# Altium project SOM Board with RK3399.PrjPcb
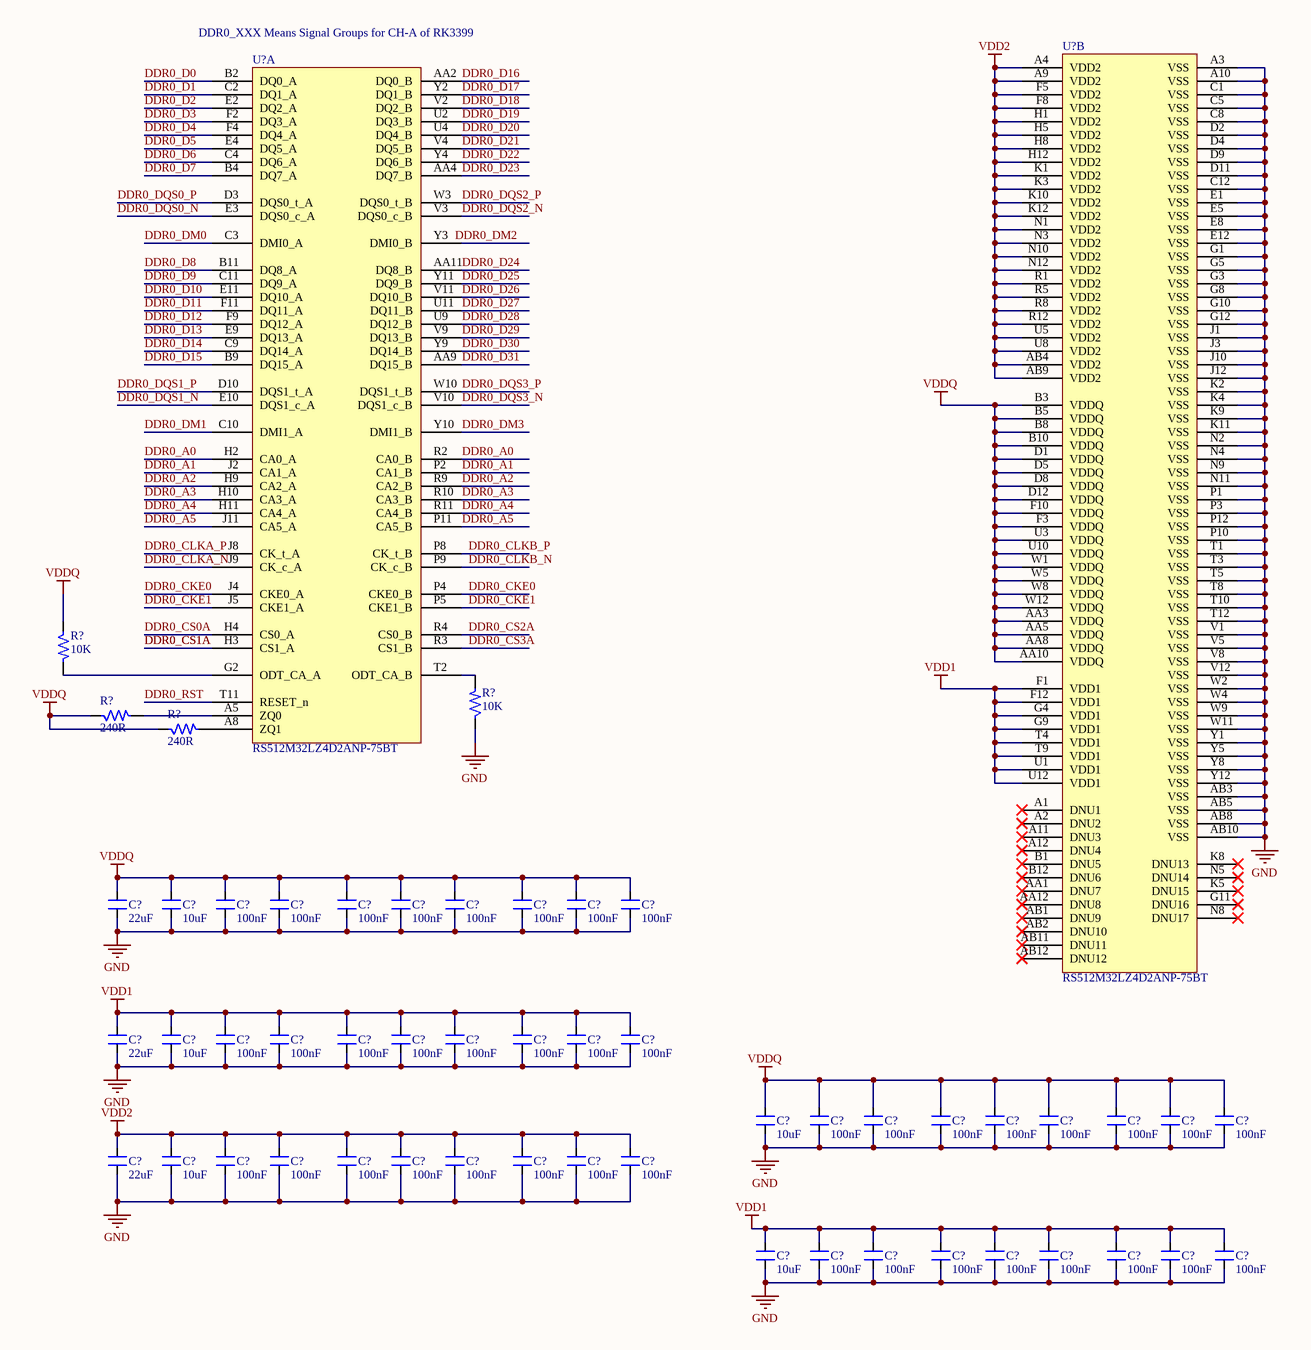
[diagram p0: [1]-LPDDR4 SDRAM-1.SchDoc]
7 sheets, 212 parts. Net scope: global (net labels, ports and power ports of the same name join across sheets).
Sheets:
  [1]-LPDDR4 SDRAM-1.SchDoc
  [2]-LPDDR4 SDRAM-2.SchDoc
  [3]-EMMC Chip.SchDoc
  [4]-WIFI Module WF60.SchDoc
  [5]-Block Diagram of SOM.SchDoc
  [6]-Power Pins Page of RK3399.SchDoc
  [7]-RK3399 SDRAM Page.SchDoc

## Sheet [1]-LPDDR4 SDRAM-1.SchDoc
size A3

### Parts
(Parts that share a designator on the sheet are numbered #1, #2 ... from top to bottom, then left to right.)
C?#1  22uF  [CAP_0603]
C?#2  10uF  [CAP_0603]
C?#3  100nF  [CAP_0201]
C?#4  100nF  [CAP_0201]
C?#5  100nF  [CAP_0201]
C?#6  100nF  [CAP_0201]
C?#7  100nF  [CAP_0201]
C?#8  100nF  [CAP_0201]
C?#9  100nF  [CAP_0201]
C?#10  100nF  [CAP_0201]
C?#11  22uF  [CAP_0603]
C?#12  10uF  [CAP_0603]
C?#13  100nF  [CAP_0201]
C?#14  100nF  [CAP_0201]
C?#15  100nF  [CAP_0201]
C?#16  100nF  [CAP_0201]
C?#17  100nF  [CAP_0201]
C?#18  100nF  [CAP_0201]
C?#19  100nF  [CAP_0201]
C?#20  100nF  [CAP_0201]
C?#21  10uF  [CAP_0603]
C?#22  100nF  [CAP_0201]
C?#23  100nF  [CAP_0201]
C?#24  100nF  [CAP_0201]
C?#25  100nF  [CAP_0201]
C?#26  100nF  [CAP_0201]
C?#27  100nF  [CAP_0201]
C?#28  100nF  [CAP_0201]
C?#29  100nF  [CAP_0201]
C?#30  22uF  [CAP_0603]
C?#31  10uF  [CAP_0603]
C?#32  100nF  [CAP_0201]
C?#33  100nF  [CAP_0201]
C?#34  100nF  [CAP_0201]
C?#35  100nF  [CAP_0201]
C?#36  100nF  [CAP_0201]
C?#37  100nF  [CAP_0201]
C?#38  100nF  [CAP_0201]
C?#39  100nF  [CAP_0201]
C?#40  10uF  [CAP_0603]
C?#41  100nF  [CAP_0201]
C?#42  100nF  [CAP_0201]
C?#43  100nF  [CAP_0201]
C?#44  100nF  [CAP_0201]
C?#45  100nF  [CAP_0201]
C?#46  100nF  [CAP_0201]
C?#47  100nF  [CAP_0201]
C?#48  100nF  [CAP_0201]
R?#1  10K  [RES_0201]
R?#2  240R  [RES_0201]
R?#3  240R  [RES_0201]
R?#4  10K  [RES_0201]
U?#1  RS512M32LZ4D2ANP-75BT  [FBGA200_SMD]  (part B of 2)
U?#2  RS512M32LZ4D2ANP-75BT  [FBGA200_SMD]  (part A of 2)

### Nets
GND: C?#1.1 C?#2.1 C?#3.1 C?#4.1 C?#5.1 C?#6.1 C?#7.1 C?#8.1 C?#9.1 C?#10.1 C?#11.1 C?#12.1 C?#13.1 C?#14.1 C?#15.1 C?#16.1 C?#17.1 C?#18.1 C?#19.1 C?#20.1 C?#21.1 C?#22.1 C?#23.1 C?#24.1 C?#25.1 C?#26.1 C?#27.1 C?#28.1 C?#29.1 C?#30.1 C?#31.1 C?#32.1 C?#33.1 C?#34.1 C?#35.1 C?#36.1 C?#37.1 C?#38.1 C?#39.1 C?#40.1 C?#41.1 C?#42.1 C?#43.1 C?#44.1 C?#45.1 C?#46.1 C?#47.1 C?#48.1 R?#4.1 U?#1.A3(VSS) U?#1.A10(VSS) U?#1.AB3(VSS) U?#1.AB5(VSS) U?#1.AB8(VSS) U?#1.AB10(VSS) U?#1.C1(VSS) U?#1.C5(VSS) U?#1.C8(VSS) U?#1.C12(VSS) U?#1.D2(VSS) U?#1.D4(VSS) U?#1.D9(VSS) U?#1.D11(VSS) U?#1.E1(VSS) U?#1.E5(VSS) U?#1.E8(VSS) U?#1.E12(VSS) U?#1.G1(VSS) U?#1.G3(VSS) U?#1.G5(VSS) U?#1.G8(VSS) U?#1.G10(VSS) U?#1.G12(VSS) U?#1.J1(VSS) U?#1.J3(VSS) U?#1.J10(VSS) U?#1.J12(VSS) U?#1.K2(VSS) U?#1.K4(VSS) U?#1.K9(VSS) U?#1.K11(VSS) U?#1.N2(VSS) U?#1.N4(VSS) U?#1.N9(VSS) U?#1.N11(VSS) U?#1.P1(VSS) U?#1.P3(VSS) U?#1.P10(VSS) U?#1.P12(VSS) U?#1.T1(VSS) U?#1.T3(VSS) U?#1.T5(VSS) U?#1.T8(VSS) U?#1.T10(VSS) U?#1.T12(VSS) U?#1.V1(VSS) U?#1.V5(VSS) U?#1.V8(VSS) U?#1.V12(VSS) U?#1.W2(VSS) U?#1.W4(VSS) U?#1.W9(VSS) U?#1.W11(VSS) U?#1.Y1(VSS) U?#1.Y5(VSS) U?#1.Y8(VSS) U?#1.Y12(VSS)
VDD1: C?#11.2 C?#12.2 C?#13.2 C?#14.2 C?#15.2 C?#16.2 C?#17.2 C?#18.2 C?#19.2 C?#20.2 C?#40.2 C?#41.2 C?#42.2 C?#43.2 C?#44.2 C?#45.2 C?#46.2 C?#47.2 C?#48.2 U?#1.F1(VDD1) U?#1.F12(VDD1) U?#1.G4(VDD1) U?#1.G9(VDD1) U?#1.T4(VDD1) U?#1.T9(VDD1) U?#1.U1(VDD1) U?#1.U12(VDD1)
VDD2: C?#30.2 C?#31.2 C?#32.2 C?#33.2 C?#34.2 C?#35.2 C?#36.2 C?#37.2 C?#38.2 C?#39.2 U?#1.A4(VDD2) U?#1.A9(VDD2) U?#1.AB4(VDD2) U?#1.AB9(VDD2) U?#1.F5(VDD2) U?#1.F8(VDD2) U?#1.H1(VDD2) U?#1.H5(VDD2) U?#1.H8(VDD2) U?#1.H12(VDD2) U?#1.K1(VDD2) U?#1.K3(VDD2) U?#1.K10(VDD2) U?#1.K12(VDD2) U?#1.N1(VDD2) U?#1.N3(VDD2) U?#1.N10(VDD2) U?#1.N12(VDD2) U?#1.R1(VDD2) U?#1.R5(VDD2) U?#1.R8(VDD2) U?#1.R12(VDD2) U?#1.U5(VDD2) U?#1.U8(VDD2)
VDDQ: C?#1.2 C?#2.2 C?#3.2 C?#4.2 C?#5.2 C?#6.2 C?#7.2 C?#8.2 C?#9.2 C?#10.2 C?#21.2 C?#22.2 C?#23.2 C?#24.2 C?#25.2 C?#26.2 C?#27.2 C?#28.2 C?#29.2 R?#1.1 R?#2.1 R?#3.1 U?#1.AA3(VDDQ) U?#1.AA5(VDDQ) U?#1.AA8(VDDQ) U?#1.AA10(VDDQ) U?#1.B3(VDDQ) U?#1.B5(VDDQ) U?#1.B8(VDDQ) U?#1.B10(VDDQ) U?#1.D1(VDDQ) U?#1.D5(VDDQ) U?#1.D8(VDDQ) U?#1.D12(VDDQ) U?#1.F3(VDDQ) U?#1.F10(VDDQ) U?#1.U3(VDDQ) U?#1.U10(VDDQ) U?#1.W1(VDDQ) U?#1.W5(VDDQ) U?#1.W8(VDDQ) U?#1.W12(VDDQ)
DDR0_A0: U?#2.H2(CA0_A) U?#2.R2(CA0_B)
DDR0_A1: U?#2.J2(CA1_A) U?#2.P2(CA1_B)
DDR0_A2: U?#2.H9(CA2_A) U?#2.R9(CA2_B)
DDR0_A3: U?#2.H10(CA3_A) U?#2.R10(CA3_B)
DDR0_A4: U?#2.H11(CA4_A) U?#2.R11(CA4_B)
DDR0_A5: U?#2.J11(CA5_A) U?#2.P11(CA5_B)
DDR0_CKE0: U?#2.J4(CKE0_A) U?#2.P4(CKE0_B)
DDR0_CKE1: U?#2.J5(CKE1_A) U?#2.P5(CKE1_B)
DDR0_CLKA_N: U?#2.J9(CK_c_A)
DDR0_CLKA_P: U?#2.J8(CK_t_A)
DDR0_CLKB_N: U?#2.P9(CK_c_B)
DDR0_CLKB_P: U?#2.P8(CK_t_B)
DDR0_CS0A: U?#2.H4(CS0_A)
DDR0_CS1A: U?#2.H3(CS1_A)
DDR0_CS2A: U?#2.R4(CS0_B)
DDR0_CS3A: U?#2.R3(CS1_B)
DDR0_D0: U?#2.B2(DQ0_A)
DDR0_D1: U?#2.C2(DQ1_A)
DDR0_D2: U?#2.E2(DQ2_A)
DDR0_D3: U?#2.F2(DQ3_A)
DDR0_D4: U?#2.F4(DQ4_A)
DDR0_D5: U?#2.E4(DQ5_A)
DDR0_D6: U?#2.C4(DQ6_A)
DDR0_D7: U?#2.B4(DQ7_A)
DDR0_D8: U?#2.B11(DQ8_A)
DDR0_D9: U?#2.C11(DQ9_A)
DDR0_D10: U?#2.E11(DQ10_A)
DDR0_D11: U?#2.F11(DQ11_A)
DDR0_D12: U?#2.F9(DQ12_A)
DDR0_D13: U?#2.E9(DQ13_A)
DDR0_D14: U?#2.C9(DQ14_A)
DDR0_D15: U?#2.B9(DQ15_A)
DDR0_D16: U?#2.AA2(DQ0_B)
DDR0_D17: U?#2.Y2(DQ1_B)
DDR0_D18: U?#2.V2(DQ2_B)
DDR0_D19: U?#2.U2(DQ3_B)
DDR0_D20: U?#2.U4(DQ4_B)
DDR0_D21: U?#2.V4(DQ5_B)
DDR0_D22: U?#2.Y4(DQ6_B)
DDR0_D23: U?#2.AA4(DQ7_B)
DDR0_D24: U?#2.AA11(DQ8_B)
DDR0_D25: U?#2.Y11(DQ9_B)
DDR0_D26: U?#2.V11(DQ10_B)
DDR0_D27: U?#2.U11(DQ11_B)
DDR0_D28: U?#2.U9(DQ12_B)
DDR0_D29: U?#2.V9(DQ13_B)
DDR0_D30: U?#2.Y9(DQ14_B)
DDR0_D31: U?#2.AA9(DQ15_B)
DDR0_DM0: U?#2.C3(DMI0_A)
DDR0_DM1: U?#2.C10(DMI1_A)
DDR0_DM3: U?#2.Y10(DMI1_B)
DDR0_DQS0_N: U?#2.E3(DQS0_c_A)
DDR0_DQS0_P: U?#2.D3(DQS0_t_A)
DDR0_DQS1_N: U?#2.E10(DQS1_c_A)
DDR0_DQS1_P: U?#2.D10(DQS1_t_A)
DDR0_DQS2_N: U?#2.V3(DQS0_c_B)
DDR0_DQS2_P: U?#2.W3(DQS0_t_B)
DDR0_DQS3_N: U?#2.V10(DQS1_c_B)
DDR0_DQS3_P: U?#2.W10(DQS1_t_B)
DDR0_RST: U?#2.T11(RESET_n)
NetR?#1_2: R?#1.2 U?#2.G2(ODT_CA_A)
NetR?#2_2: R?#2.2 U?#2.A5(ZQ0)
NetR?#3_2: R?#3.2 U?#2.A8(ZQ1)
NetR?#4_2: R?#4.2 U?#2.T2(ODT_CA_B)

Not connected (* = marked no-connect by the designer): U?#1 A1(DNU1)* A2(DNU2)* A11(DNU3)* A12(DNU4)* AA1(DNU7)* AA12(DNU8)* AB1(DNU9)* AB2(DNU10)* AB11(DNU11)* AB12(DNU12)* B1(DNU5)* B12(DNU6)* G11(DNU16)* K5(DNU15)* K8(DNU13)* N5(DNU14)* N8(DNU17)*; U?#2 Y3(DMI0_B)

### Notes on the sheet
- (near U?#2) DDR0_XXX Means Signal Groups for CH-A of RK3399
- Labels drawn without touching a wire or pin: DDR0_DM2
- Title
- Size:
- Date:
- A3
- Number:
- Time:
- Revision:
- Sheet
- of
- File:

### Library data of the parts
C?#1 C?#11 C?#30 = CAP_22uF-10V-20%-0603: 22µF ±20% 10V Ceramic Capacitor X5R 0603 (1608 Metric) /; Manufacturer: Murata Electronics; Manufacturer Part Number: GRM188R61A226ME15D; Case/Package: 0603; Supplier-1: Digikey
C?#2 C?#12 C?#21 C?#31 C?#40 = CAP_10uF-10V-10%-0603: 10µF ±10% 10V Ceramic Capacitor X5R 0603 (1608 Metric) /; Manufacturer Part Number: GRM188R61A106KE69J; Manufacturer: Murata Electronics; Case/Package: 0603; Supplier-1: Digikey
C?#3-C?#10 C?#13-C?#20 C?#22-C?#29 C?#32-C?#39 C?#41-C?#48 = CAP_100nF-25V-10%-0201: 0.1µF ±10% 25V Ceramic Capacitor X5R 0201 (0603 Metric) /; Manufacturer: TDK Corporation; Manufacturer Part Number: C0603X5R1E104K030BB; Case/Package: 0201; Supplier-1: Digikey
R?#1 R?#4 = RES_10K-0.05W-1%-0201: 10 kOhms ±1% 0.05W, 1/20W Chip Resistor 0201 (0603 Metric) Thick Film /; Manufacturer: Stackpole Electronics Inc; Manufacturer Part Number: RMCF0201FT10K0; Case/Package: 0201; Supplier-1: Digikey
R?#2 R?#3 = RES_240R-0.05W-1%-0201: 240 Ohms ±1% 0.05W, 1/20W Chip Resistor 0201 (0603 Metric) Thick Film /; Manufacturer: Yageo; Manufacturer Part Number: RC0201FR-07240RL; Case/Package: 0201; Supplier-1: Digikey
U?#1 U?#2 = IC_RS512M32LZ4D2ANP-75BT: LPDDR4/4X Package FBGA 200b Density 4Gbit~64Gbit Operating Temperature Range：-25~85℃ Speed：2667Mbps/3200Mbps/3733Mbps Voltage：VDD1/VDD2/VDDQ= 1.8 / 1.1 / 1.1 V（LPDDR4）VDD1/VDD2/VDDQ = 1.8 / 1.1 / 0.6 V（LPDDR4X）Approved Verification Platform：MTK、Spreadtrum; Manufacturer: RAYSON; Manufacturer Part Number: RS512M32LZ4D2ANP-75BT; Case/Package: FBGA 200b; Supplier-1: RAYSON

## Sheet [2]-LPDDR4 SDRAM-2.SchDoc
size A3; Organization: Altium Limited; Address1: L3, 12a Rodborough Rd; Address2: Frenchs Forest; Address3: NSW; Address4: Australia 2086
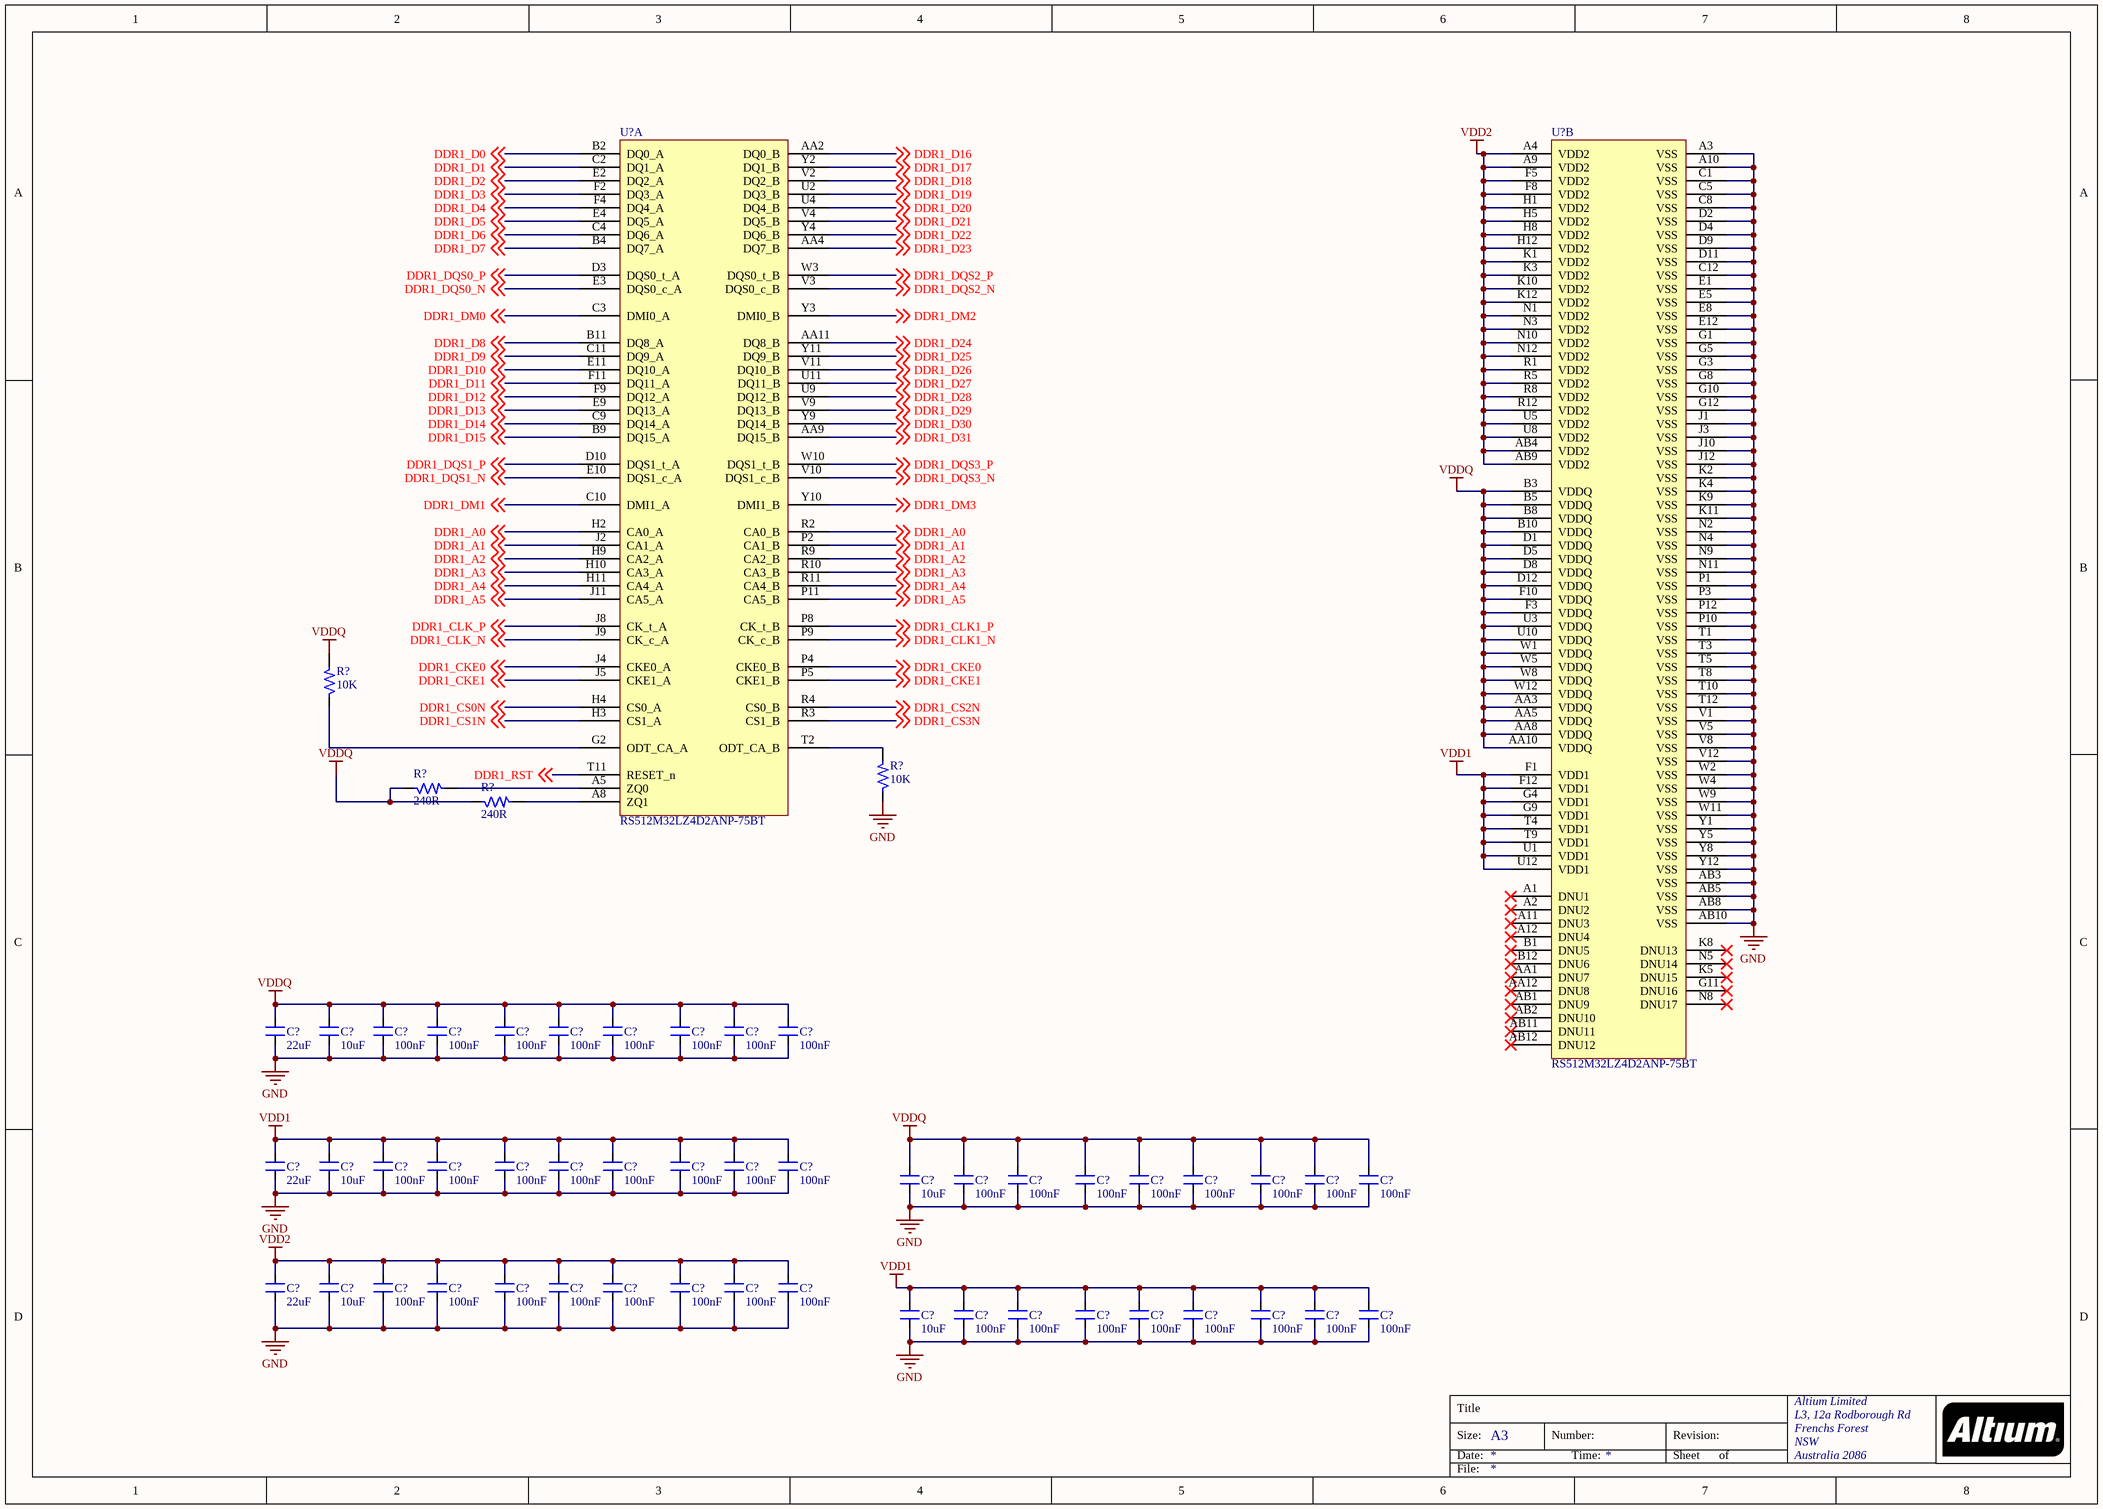
[diagram p1: [2]-LPDDR4 SDRAM-2.SchDoc]

### Parts
(Parts that share a designator on the sheet are numbered #1, #2 ... from top to bottom, then left to right.)
C?#49  22uF  [CAP_0603]
C?#50  10uF  [CAP_0603]
C?#51  100nF  [CAP_0201]
C?#52  100nF  [CAP_0201]
C?#53  100nF  [CAP_0201]
C?#54  100nF  [CAP_0201]
C?#55  100nF  [CAP_0201]
C?#56  100nF  [CAP_0201]
C?#57  100nF  [CAP_0201]
C?#58  100nF  [CAP_0201]
C?#59  22uF  [CAP_0603]
C?#60  10uF  [CAP_0603]
C?#61  100nF  [CAP_0201]
C?#62  100nF  [CAP_0201]
C?#63  100nF  [CAP_0201]
C?#64  100nF  [CAP_0201]
C?#65  100nF  [CAP_0201]
C?#66  100nF  [CAP_0201]
C?#67  100nF  [CAP_0201]
C?#68  100nF  [CAP_0201]
C?#69  10uF  [CAP_0603]
C?#70  100nF  [CAP_0201]
C?#71  100nF  [CAP_0201]
C?#72  100nF  [CAP_0201]
C?#73  100nF  [CAP_0201]
C?#74  100nF  [CAP_0201]
C?#75  100nF  [CAP_0201]
C?#76  100nF  [CAP_0201]
C?#77  100nF  [CAP_0201]
C?#78  22uF  [CAP_0603]
C?#79  10uF  [CAP_0603]
C?#80  100nF  [CAP_0201]
C?#81  100nF  [CAP_0201]
C?#82  100nF  [CAP_0201]
C?#83  100nF  [CAP_0201]
C?#84  100nF  [CAP_0201]
C?#85  100nF  [CAP_0201]
C?#86  100nF  [CAP_0201]
C?#87  100nF  [CAP_0201]
C?#88  10uF  [CAP_0603]
C?#89  100nF  [CAP_0201]
C?#90  100nF  [CAP_0201]
C?#91  100nF  [CAP_0201]
C?#92  100nF  [CAP_0201]
C?#93  100nF  [CAP_0201]
C?#94  100nF  [CAP_0201]
C?#95  100nF  [CAP_0201]
C?#96  100nF  [CAP_0201]
R?#5  10K  [RES_0201]
R?#6  240R  [RES_0201]
R?#7  240R  [RES_0201]
R?#8  10K  [RES_0201]
U?#3  RS512M32LZ4D2ANP-75BT  [FBGA200_SMD]  (part A of 2)
U?#4  RS512M32LZ4D2ANP-75BT  [FBGA200_SMD]  (part B of 2)

### Nets
GND: C?#49.1 C?#50.1 C?#51.1 C?#52.1 C?#53.1 C?#54.1 C?#55.1 C?#56.1 C?#57.1 C?#58.1 C?#59.1 C?#60.1 C?#61.1 C?#62.1 C?#63.1 C?#64.1 C?#65.1 C?#66.1 C?#67.1 C?#68.1 C?#69.1 C?#70.1 C?#71.1 C?#72.1 C?#73.1 C?#74.1 C?#75.1 C?#76.1 C?#77.1 C?#78.1 C?#79.1 C?#80.1 C?#81.1 C?#82.1 C?#83.1 C?#84.1 C?#85.1 C?#86.1 C?#87.1 C?#88.1 C?#89.1 C?#90.1 C?#91.1 C?#92.1 C?#93.1 C?#94.1 C?#95.1 C?#96.1 R?#8.1 U?#4.A3(VSS) U?#4.A10(VSS) U?#4.AB3(VSS) U?#4.AB5(VSS) U?#4.AB8(VSS) U?#4.AB10(VSS) U?#4.C1(VSS) U?#4.C5(VSS) U?#4.C8(VSS) U?#4.C12(VSS) U?#4.D2(VSS) U?#4.D4(VSS) U?#4.D9(VSS) U?#4.D11(VSS) U?#4.E1(VSS) U?#4.E5(VSS) U?#4.E8(VSS) U?#4.E12(VSS) U?#4.G1(VSS) U?#4.G3(VSS) U?#4.G5(VSS) U?#4.G8(VSS) U?#4.G10(VSS) U?#4.G12(VSS) U?#4.J1(VSS) U?#4.J3(VSS) U?#4.J10(VSS) U?#4.J12(VSS) U?#4.K2(VSS) U?#4.K4(VSS) U?#4.K9(VSS) U?#4.K11(VSS) U?#4.N2(VSS) U?#4.N4(VSS) U?#4.N9(VSS) U?#4.N11(VSS) U?#4.P1(VSS) U?#4.P3(VSS) U?#4.P10(VSS) U?#4.P12(VSS) U?#4.T1(VSS) U?#4.T3(VSS) U?#4.T5(VSS) U?#4.T8(VSS) U?#4.T10(VSS) U?#4.T12(VSS) U?#4.V1(VSS) U?#4.V5(VSS) U?#4.V8(VSS) U?#4.V12(VSS) U?#4.W2(VSS) U?#4.W4(VSS) U?#4.W9(VSS) U?#4.W11(VSS) U?#4.Y1(VSS) U?#4.Y5(VSS) U?#4.Y8(VSS) U?#4.Y12(VSS)
VDD1: C?#59.2 C?#60.2 C?#61.2 C?#62.2 C?#63.2 C?#64.2 C?#65.2 C?#66.2 C?#67.2 C?#68.2 C?#88.2 C?#89.2 C?#90.2 C?#91.2 C?#92.2 C?#93.2 C?#94.2 C?#95.2 C?#96.2 U?#4.F1(VDD1) U?#4.F12(VDD1) U?#4.G4(VDD1) U?#4.G9(VDD1) U?#4.T4(VDD1) U?#4.T9(VDD1) U?#4.U1(VDD1) U?#4.U12(VDD1)
VDD2: C?#78.2 C?#79.2 C?#80.2 C?#81.2 C?#82.2 C?#83.2 C?#84.2 C?#85.2 C?#86.2 C?#87.2 U?#4.A4(VDD2) U?#4.A9(VDD2) U?#4.AB4(VDD2) U?#4.AB9(VDD2) U?#4.F5(VDD2) U?#4.F8(VDD2) U?#4.H1(VDD2) U?#4.H5(VDD2) U?#4.H8(VDD2) U?#4.H12(VDD2) U?#4.K1(VDD2) U?#4.K3(VDD2) U?#4.K10(VDD2) U?#4.K12(VDD2) U?#4.N1(VDD2) U?#4.N3(VDD2) U?#4.N10(VDD2) U?#4.N12(VDD2) U?#4.R1(VDD2) U?#4.R5(VDD2) U?#4.R8(VDD2) U?#4.R12(VDD2) U?#4.U5(VDD2) U?#4.U8(VDD2)
VDDQ: C?#49.2 C?#50.2 C?#51.2 C?#52.2 C?#53.2 C?#54.2 C?#55.2 C?#56.2 C?#57.2 C?#58.2 C?#69.2 C?#70.2 C?#71.2 C?#72.2 C?#73.2 C?#74.2 C?#75.2 C?#76.2 C?#77.2 R?#5.2 R?#6.1 R?#7.1 U?#4.AA3(VDDQ) U?#4.AA5(VDDQ) U?#4.AA8(VDDQ) U?#4.AA10(VDDQ) U?#4.B3(VDDQ) U?#4.B5(VDDQ) U?#4.B8(VDDQ) U?#4.B10(VDDQ) U?#4.D1(VDDQ) U?#4.D5(VDDQ) U?#4.D8(VDDQ) U?#4.D12(VDDQ) U?#4.F3(VDDQ) U?#4.F10(VDDQ) U?#4.U3(VDDQ) U?#4.U10(VDDQ) U?#4.W1(VDDQ) U?#4.W5(VDDQ) U?#4.W8(VDDQ) U?#4.W12(VDDQ)
DDR1_A0: U?#3.H2(CA0_A) U?#3.R2(CA0_B) ; off-sheet DDR1_A0
DDR1_A1: U?#3.J2(CA1_A) U?#3.P2(CA1_B) ; off-sheet DDR1_A1
DDR1_A2: U?#3.H9(CA2_A) U?#3.R9(CA2_B) ; off-sheet DDR1_A2
DDR1_A3: U?#3.H10(CA3_A) U?#3.R10(CA3_B) ; off-sheet DDR1_A3
DDR1_A4: U?#3.H11(CA4_A) U?#3.R11(CA4_B) ; off-sheet DDR1_A4
DDR1_A5: U?#3.J11(CA5_A) U?#3.P11(CA5_B) ; off-sheet DDR1_A5
DDR1_CKE0: U?#3.J4(CKE0_A) U?#3.P4(CKE0_B) ; off-sheet DDR1_CKE0
DDR1_CKE1: U?#3.J5(CKE1_A) U?#3.P5(CKE1_B) ; off-sheet DDR1_CKE1
DDR1_CLK1_N: U?#3.P9(CK_c_B) ; off-sheet DDR1_CLK1_N
DDR1_CLK1_P: U?#3.P8(CK_t_B) ; off-sheet DDR1_CLK1_P
DDR1_CLK_N: U?#3.J9(CK_c_A) ; off-sheet DDR1_CLK_N
DDR1_CLK_P: U?#3.J8(CK_t_A) ; off-sheet DDR1_CLK_P
DDR1_CS0N: U?#3.H4(CS0_A) ; off-sheet DDR1_CS0N
DDR1_CS1N: U?#3.H3(CS1_A) ; off-sheet DDR1_CS1N
DDR1_CS2N: U?#3.R4(CS0_B) ; off-sheet DDR1_CS2N
DDR1_CS3N: U?#3.R3(CS1_B) ; off-sheet DDR1_CS3N
DDR1_D0: U?#3.B2(DQ0_A) ; off-sheet DDR1_D0
DDR1_D1: U?#3.C2(DQ1_A) ; off-sheet DDR1_D1
DDR1_D2: U?#3.E2(DQ2_A) ; off-sheet DDR1_D2
DDR1_D3: U?#3.F2(DQ3_A) ; off-sheet DDR1_D3
DDR1_D4: U?#3.F4(DQ4_A) ; off-sheet DDR1_D4
DDR1_D5: U?#3.E4(DQ5_A) ; off-sheet DDR1_D5
DDR1_D6: U?#3.C4(DQ6_A) ; off-sheet DDR1_D6
DDR1_D7: U?#3.B4(DQ7_A) ; off-sheet DDR1_D7
DDR1_D8: U?#3.B11(DQ8_A) ; off-sheet DDR1_D8
DDR1_D9: U?#3.C11(DQ9_A) ; off-sheet DDR1_D9
DDR1_D10: U?#3.E11(DQ10_A) ; off-sheet DDR1_D10
DDR1_D11: U?#3.F11(DQ11_A) ; off-sheet DDR1_D11
DDR1_D12: U?#3.F9(DQ12_A) ; off-sheet DDR1_D12
DDR1_D13: U?#3.E9(DQ13_A) ; off-sheet DDR1_D13
DDR1_D14: U?#3.C9(DQ14_A) ; off-sheet DDR1_D14
DDR1_D15: U?#3.B9(DQ15_A) ; off-sheet DDR1_D15
DDR1_D16: U?#3.AA2(DQ0_B) ; off-sheet DDR1_D16
DDR1_D17: U?#3.Y2(DQ1_B) ; off-sheet DDR1_D17
DDR1_D18: U?#3.V2(DQ2_B) ; off-sheet DDR1_D18
DDR1_D19: U?#3.U2(DQ3_B) ; off-sheet DDR1_D19
DDR1_D20: U?#3.U4(DQ4_B) ; off-sheet DDR1_D20
DDR1_D21: U?#3.V4(DQ5_B) ; off-sheet DDR1_D21
DDR1_D22: U?#3.Y4(DQ6_B) ; off-sheet DDR1_D22
DDR1_D23: U?#3.AA4(DQ7_B) ; off-sheet DDR1_D23
DDR1_D24: U?#3.AA11(DQ8_B) ; off-sheet DDR1_D24
DDR1_D25: U?#3.Y11(DQ9_B) ; off-sheet DDR1_D25
DDR1_D26: U?#3.V11(DQ10_B) ; off-sheet DDR1_D26
DDR1_D27: U?#3.U11(DQ11_B) ; off-sheet DDR1_D27
DDR1_D28: U?#3.U9(DQ12_B) ; off-sheet DDR1_D28
DDR1_D29: U?#3.V9(DQ13_B) ; off-sheet DDR1_D29
DDR1_D30: U?#3.Y9(DQ14_B) ; off-sheet DDR1_D30
DDR1_D31: U?#3.AA9(DQ15_B) ; off-sheet DDR1_D31
DDR1_DM0: U?#3.C3(DMI0_A) ; off-sheet DDR1_DM0
DDR1_DM1: U?#3.C10(DMI1_A) ; off-sheet DDR1_DM1
DDR1_DM2: U?#3.Y3(DMI0_B) ; off-sheet DDR1_DM2
DDR1_DM3: U?#3.Y10(DMI1_B) ; off-sheet DDR1_DM3
DDR1_DQS0_N: U?#3.E3(DQS0_c_A) ; off-sheet DDR1_DQS0_N
DDR1_DQS0_P: U?#3.D3(DQS0_t_A) ; off-sheet DDR1_DQS0_P
DDR1_DQS1_N: U?#3.E10(DQS1_c_A) ; off-sheet DDR1_DQS1_N
DDR1_DQS1_P: U?#3.D10(DQS1_t_A) ; off-sheet DDR1_DQS1_P
DDR1_DQS2_N: U?#3.V3(DQS0_c_B) ; off-sheet DDR1_DQS2_N
DDR1_DQS2_P: U?#3.W3(DQS0_t_B) ; off-sheet DDR1_DQS2_P
DDR1_DQS3_N: U?#3.V10(DQS1_c_B) ; off-sheet DDR1_DQS3_N
DDR1_DQS3_P: U?#3.W10(DQS1_t_B) ; off-sheet DDR1_DQS3_P
DDR1_RST: U?#3.T11(RESET_n) ; off-sheet DDR1_RST
NetR?#5_1: R?#5.1 U?#3.G2(ODT_CA_A)
NetR?#6_2: R?#6.2 U?#3.A5(ZQ0)
NetR?#7_2: R?#7.2 U?#3.A8(ZQ1)
NetR?#8_2: R?#8.2 U?#3.T2(ODT_CA_B)

Not connected (* = marked no-connect by the designer): U?#4 A1(DNU1)* A2(DNU2)* A11(DNU3)* A12(DNU4)* AA1(DNU7)* AA12(DNU8)* AB1(DNU9)* AB2(DNU10)* AB11(DNU11)* AB12(DNU12)* B1(DNU5)* B12(DNU6)* G11(DNU16)* K5(DNU15)* K8(DNU13)* N5(DNU14)* N8(DNU17)*

### Notes on the sheet
- Title
- Size:
- Date:
- A3
- Number:
- Time:
- Revision:
- Sheet
- of
- File:

### Library data of the parts
C?#49 C?#59 C?#78 = CAP_22uF-10V-20%-0603: as C?#1 on sheet [1]-LPDDR4 SDRAM-1; Case/Package: 0603; Supplier-1: Digikey
C?#50 C?#60 C?#69 C?#79 C?#88 = CAP_10uF-10V-10%-0603: as C?#2 on sheet [1]-LPDDR4 SDRAM-1; Case/Package: 0603; Supplier-1: Digikey
C?#51-C?#58 C?#61-C?#68 C?#70-C?#77 C?#80-C?#87 C?#89-C?#96 = CAP_100nF-25V-10%-0201: as C?#3 on sheet [1]-LPDDR4 SDRAM-1; Case/Package: 0201; Supplier-1: Digikey
R?#5 R?#8 = RES_10K-0.05W-1%-0201: as R?#1 on sheet [1]-LPDDR4 SDRAM-1; Case/Package: 0201; Supplier-1: Digikey
R?#6 R?#7 = RES_240R-0.05W-1%-0201: as R?#2 on sheet [1]-LPDDR4 SDRAM-1; Case/Package: 0201; Supplier-1: Digikey
U?#3 U?#4 = IC_RS512M32LZ4D2ANP-75BT: as U?#1 on sheet [1]-LPDDR4 SDRAM-1; Manufacturer Part Number: RS512M32LZ4D2ANP-75BT; Case/Package: FBGA 200b; Supplier-1: RAYSON

## Sheet [3]-EMMC Chip.SchDoc
size A3; Organization: Altium Limited; Address1: L3, 12a Rodborough Rd; Address2: Frenchs Forest; Address3: NSW; Address4: Australia 2086
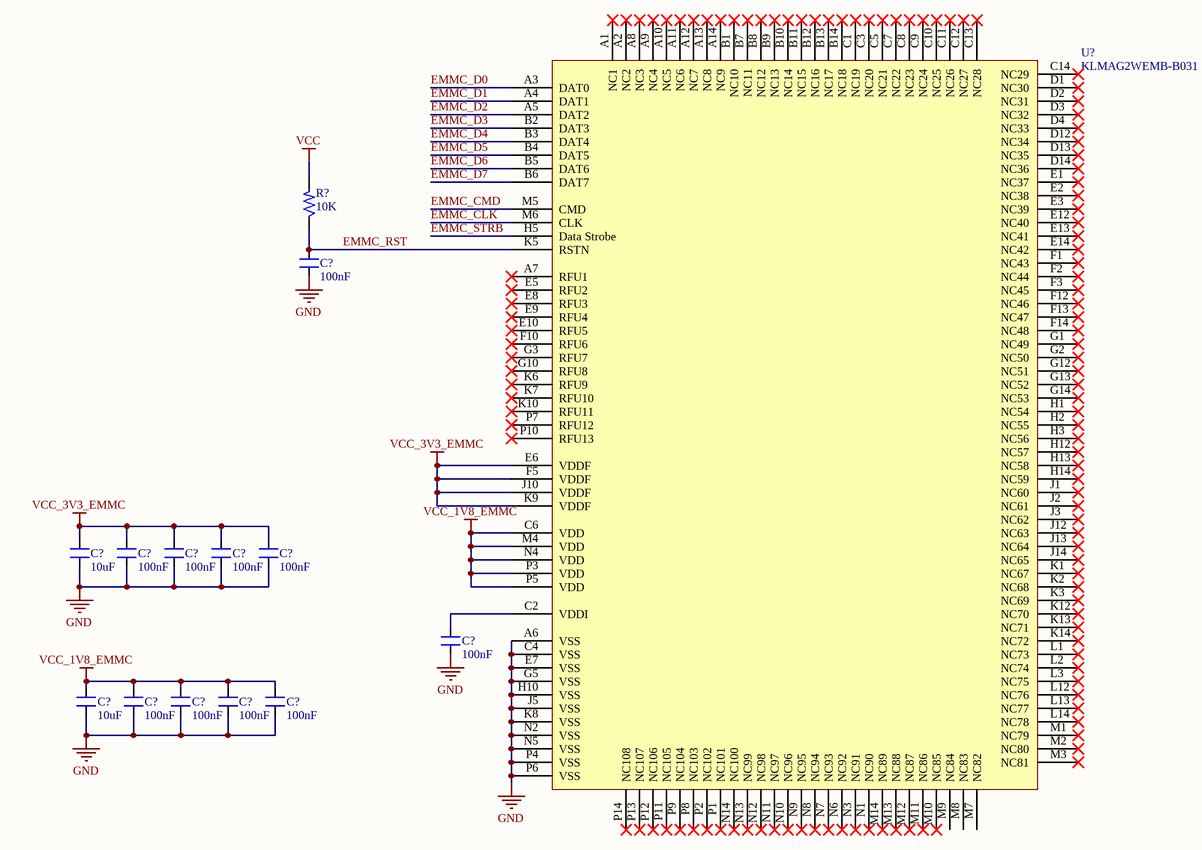
[diagram p2: [3]-EMMC Chip.SchDoc]

### Parts
(Parts that share a designator on the sheet are numbered #1, #2 ... from top to bottom, then left to right.)
C?#97  100nF  [CAP_0201]
C?#98  10uF  [CAP_0603]
C?#99  100nF  [CAP_0201]
C?#100  100nF  [CAP_0201]
C?#101  100nF  [CAP_0201]
C?#102  100nF  [CAP_0201]
C?#103  100nF  [CAP_0201]
C?#104  10uF  [CAP_0603]
C?#105  100nF  [CAP_0201]
C?#106  100nF  [CAP_0201]
C?#107  100nF  [CAP_0201]
C?#108  100nF  [CAP_0201]
R?#9  10K  [RES_0201]
U?#5  KLMAG2WEMB-B031  [BGA153C50P14X14_1150X1300X70]

### Nets
GND: C?#97.1 C?#98.1 C?#99.1 C?#100.1 C?#101.1 C?#102.1 C?#103.1 C?#104.1 C?#105.1 C?#106.1 C?#107.1 C?#108.1 U?#5.A6(VSS) U?#5.C4(VSS) U?#5.E7(VSS) U?#5.G5(VSS) U?#5.H10(VSS) U?#5.J5(VSS) U?#5.K8(VSS) U?#5.N2(VSS) U?#5.N5(VSS) U?#5.P4(VSS) U?#5.P6(VSS)
VCC: R?#9.2
VCC_1V8_EMMC: C?#104.2 C?#105.2 C?#106.2 C?#107.2 C?#108.2 U?#5.C6(VDD) U?#5.M4(VDD) U?#5.N4(VDD) U?#5.P3(VDD) U?#5.P5(VDD)
VCC_3V3_EMMC: C?#98.2 C?#99.2 C?#100.2 C?#101.2 C?#102.2 U?#5.E6(VDDF) U?#5.F5(VDDF) U?#5.J10(VDDF) U?#5.K9(VDDF)
EMMC_CLK: U?#5.M6(CLK)
EMMC_CMD: U?#5.M5(CMD)
EMMC_D0: U?#5.A3(DAT0)
EMMC_D1: U?#5.A4(DAT1)
EMMC_D2: U?#5.A5(DAT2)
EMMC_D3: U?#5.B2(DAT3)
EMMC_D4: U?#5.B3(DAT4)
EMMC_D5: U?#5.B4(DAT5)
EMMC_D6: U?#5.B5(DAT6)
EMMC_D7: U?#5.B6(DAT7)
EMMC_RST: C?#97.2 R?#9.1 U?#5.K5(RSTN)
EMMC_STRB: U?#5.H5(Data_Strobe)
NetC?#103_2: C?#103.2 U?#5.C2(VDDI)

Not connected (* = marked no-connect by the designer): U?#5 A1(NC1)* A2(NC2)* A7(RFU1)* A8(NC3)* A9(NC4)* A10(NC5)* A11(NC6)* A12(NC7)* A13(NC8)* A14(NC9)* B1(NC10)* B7(NC11)* B8(NC12)* B9(NC13)* B10(NC14)* B11(NC15)* B12(NC16)* B13(NC17)* B14(NC18)* C1(NC19)* C3(NC20)* C5(NC21)* C7(NC22)* C8(NC23)* C9(NC24)* C10(NC25)* C11(NC26)* C12(NC27)* C13(NC28)* C14(NC29)* D1(NC30)* D2(NC31)* D3(NC32)* D4(NC33)* D12(NC34)* D13(NC35)* D14(NC36)* E1(NC37)* E2(NC38)* E3(NC39)* E5(RFU2)* E8(RFU3)* E9(RFU4)* E10(RFU5)* E12(NC40)* E13(NC41)* E14(NC42)* F1(NC43)* F2(NC44)* F3(NC45)* F10(RFU6)* F12(NC46)* F13(NC47)* F14(NC48)* G1(NC49)* G2(NC50)* G3(RFU7)* G10(RFU8)* G12(NC51)* G13(NC52)* G14(NC53)* H1(NC54)* H2(NC55)* H3(NC56)* H12(NC57)* H13(NC58)* H14(NC59)* J1(NC60)* J2(NC61)* J3(NC62)* J12(NC63)* J13(NC64)* J14(NC65)* K1(NC67)* K2(NC68)* K3(NC69)* K6(RFU9)* K7(RFU10)* K10(RFU11)* K12(NC70)* K13(NC71)* K14(NC72)* L1(NC73)* L2(NC74)* L3(NC75)* L12(NC76)* L13(NC77)* L14(NC78)* M1(NC79)* M2(NC80)* M3(NC81)* M7(NC82) M8(NC83) M9(NC84) M10(NC85)* M11(NC86)* M12(NC87)* M13(NC88)* M14(NC89)* N1(NC90)* N3(NC91)* N6(NC92)* N7(NC93)* N8(NC94)* N9(NC95)* N10(NC96)* N11(NC97)* N12(NC98)* N13(NC99)* N14(NC100)* P1(NC101)* P2(NC102)* P7(RFU12)* P8(NC103)* P9(NC104)* P10(RFU13)* P11(NC105)* P12(NC106)* P13(NC107)* P14(NC108)*

### Notes on the sheet
- Title
- Size:
- Date:
- A3
- Number:
- Time:
- Revision:
- Sheet
- of
- File:

### Library data of the parts
C?#97 C?#99-C?#103 C?#105-C?#108 = CAP_100nF-25V-10%-0201: as C?#3 on sheet [1]-LPDDR4 SDRAM-1; Case/Package: 0201; Supplier-1: Digikey
C?#98 C?#104 = CAP_10uF-10V-10%-0603: as C?#2 on sheet [1]-LPDDR4 SDRAM-1; Case/Package: 0603; Supplier-1: Digikey
R?#9 = RES_10K-0.05W-1%-0201: as R?#1 on sheet [1]-LPDDR4 SDRAM-1; Case/Package: 0201; Supplier-1: Digikey
U?#5 = IC_KLMAG2WEMB-B031: 16GB NAND Flash Memory; Manufacturer: Samsung Electronics; Manufacturer Part Number: KLMAG2WEMB-B031; Case/Package: 153-FBGA; Supplier-1: NA

## Sheet [4]-WIFI Module WF60.SchDoc
size A3; Organization: Altium Limited; Address1: L3, 12a Rodborough Rd; Address2: Frenchs Forest; Address3: NSW; Address4: Australia 2086
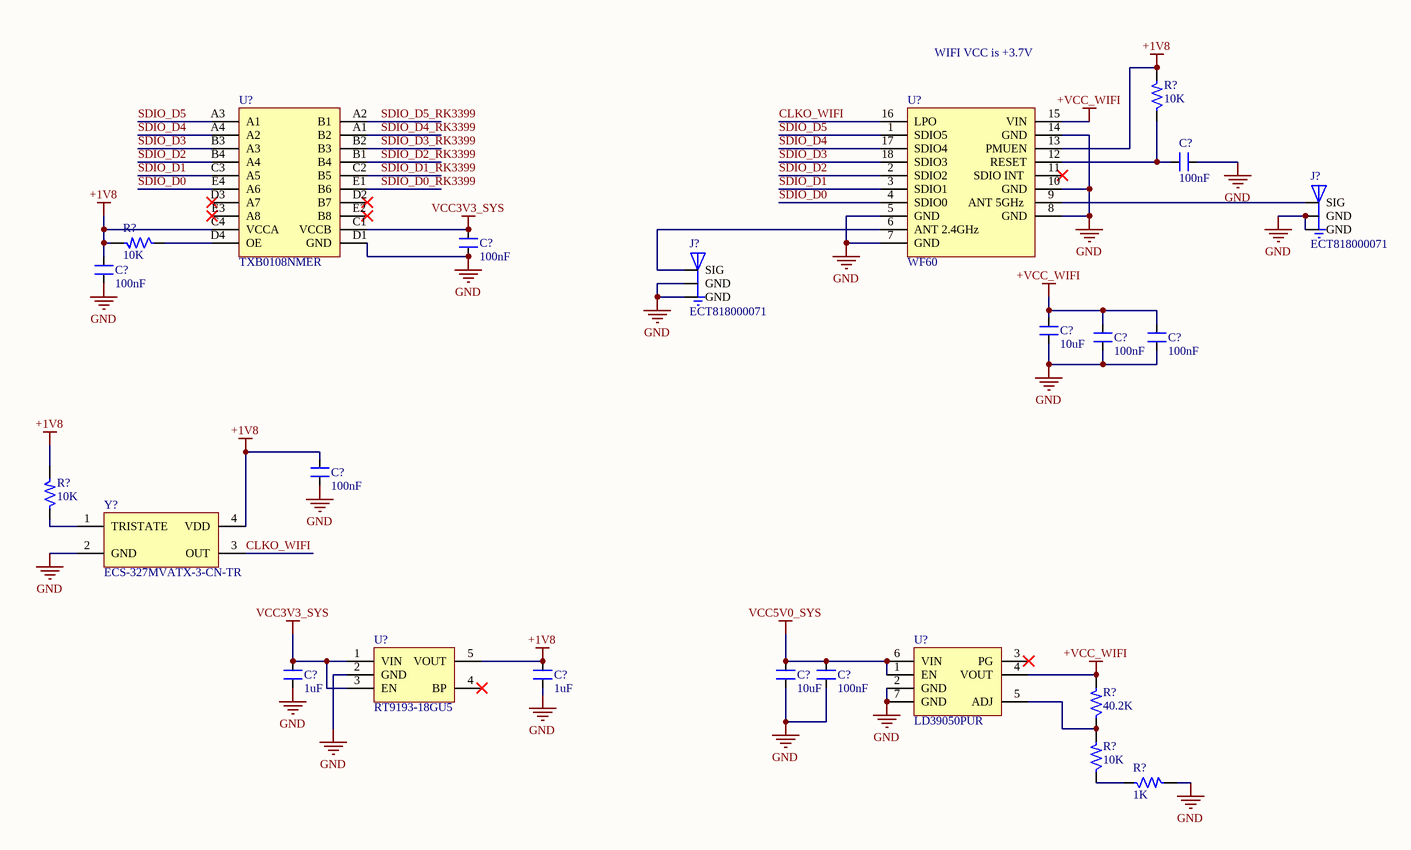
[diagram p3: [4]-WIFI Module WF60.SchDoc]

### Parts
(Parts that share a designator on the sheet are numbered #1, #2 ... from top to bottom, then left to right.)
C?#109  100nF  [CAP_0201]
C?#110  100nF  [CAP_0201]
C?#111  100nF  [CAP_0201]
C?#112  10uF  [CAP_0603]
C?#113  100nF  [CAP_0201]
C?#114  100nF  [CAP_0201]
C?#115  100nF  [CAP_0201]
C?#116  1uF  [CAP_0201]
C?#117  1uF  [CAP_0201]
C?#118  10uF  [CAP_0603]
C?#119  100nF  [CAP_0201]
J?#1  ECT818000071  [CON3_UFL_116_SMD_ST]
J?#2  ECT818000071  [CON3_UFL_116_SMD_ST]
R?#10  10K  [RES_0201]
R?#11  10K  [RES_0201]
R?#12  10K  [RES_0201]
R?#13  40.2K  [RES_0201]
R?#14  10K  [RES_0201]
R?#15  1K  [RES_0201]
U?#6  TXB0108NMER  [NFBGA_31.4_125.9X102.36]
U?#7  WF60  [MOD_WF60]
U?#8  RT9193-18GU5  [SC70-5]
U?#9  LD39050PUR  [DFN-6_37.4_165_33X15_SMD]
Y?  ECS-327MVATX-3-CN-TR  [XTAL_57_35X31_SMD]

### Nets
+1V8: C?#111.2 C?#115.2 C?#117.2 R?#10.2 R?#11.2 R?#12.2 U?#6.C4(VCCA) U?#7.13(PMUEN) U?#8.5(VOUT) Y?.4(VDD)
+VCC_WIFI: C?#112.2 C?#113.2 C?#114.2 R?#13.2 U?#7.15(VIN) U?#9.4(VOUT)
GND: C?#109.1 C?#110.1 C?#111.1 C?#112.1 C?#113.1 C?#114.1 C?#115.1 C?#116.1 C?#117.1 C?#118.1 C?#119.1 J?#1.1(GND) J?#1.3(GND) J?#2.1(GND) J?#2.3(GND) R?#15.2 U?#6.D1(GND) U?#7.5(GND) U?#7.7(GND) U?#7.8(GND) U?#7.10(GND) U?#7.14(GND) U?#8.2(GND) U?#9.2(GND) U?#9.7(GND) Y?.2(GND)
VCC3V3_SYS: C?#110.2 C?#116.2 U?#6.C1(VCCB) U?#8.1(VIN) U?#8.3(EN)
VCC5V0_SYS: C?#118.2 C?#119.2 U?#9.1(EN) U?#9.6(VIN)
CLKO_WIFI: U?#7.16(LPO) Y?.3(OUT)
SDIO_D0: U?#6.E4(A6) U?#7.4(SDIO0)
SDIO_D0_RK3399: U?#6.E1(B6)
SDIO_D1: U?#6.C3(A5) U?#7.3(SDIO1)
SDIO_D1_RK3399: U?#6.C2(B5)
SDIO_D2: U?#6.B4(A4) U?#7.2(SDIO2)
SDIO_D2_RK3399: U?#6.B1(B4)
SDIO_D3: U?#6.B3(A3) U?#7.18(SDIO3)
SDIO_D3_RK3399: U?#6.B2(B3)
SDIO_D4: U?#6.A4(A2) U?#7.17(SDIO4)
SDIO_D4_RK3399: U?#6.A1(B2)
SDIO_D5: U?#6.A3(A1) U?#7.1(SDIO5)
SDIO_D5_RK3399: U?#6.A2(B1)
NetC?#109_2: C?#109.2 R?#10.1 U?#7.12(RESET)
NetJ?#1_2: J?#1.2(SIG) U?#7.9(ANT_5GHz)
NetJ?#2_2: J?#2.2(SIG) U?#7.6(ANT_2.4GHz)
NetR?#11_1: R?#11.1 U?#6.D4(OE)
NetR?#12_1: R?#12.1 Y?.1(TRISTATE)
NetR?#13_1: R?#13.1 R?#14.2 U?#9.5(ADJ)
NetR?#14_1: R?#14.1 R?#15.1

Not connected (* = marked no-connect by the designer): U?#6 D2(B7)* D3(A7)* E2(B8)* E3(A8)*; U?#7 11(SDIO_INT_)*; U?#8 4(BP)*; U?#9 3(PG)*

### Notes on the sheet
- WIFI VCC is +3.7V
- Title
- Size:
- Date:
- A3
- Number:
- Time:
- Revision:
- Sheet
- of
- File:

### Library data of the parts
C?#109-C?#111 C?#113-C?#115 C?#119 = CAP_100nF-25V-10%-0201: as C?#3 on sheet [1]-LPDDR4 SDRAM-1; Case/Package: 0201; Supplier-1: Digikey
C?#112 C?#118 = CAP_10uF-10V-10%-0603: as C?#2 on sheet [1]-LPDDR4 SDRAM-1; Case/Package: 0603; Supplier-1: Digikey
C?#116 C?#117 = CAP_1uF-16V-10%-0201: 1µF ±20% 16V Ceramic Capacitor X5R 0201 (0603 Metric) /; Manufacturer: Samsung Electro-Mechanics; Manufacturer Part Number: CL03A105MO3NRNH; Case/Package: 0201; Supplier-1: Digikey
J?#1 J?#2 = CON-PLG_3X1-ECT818000071-ST-SMD: SMD RF Connectors/Coaxial Connectors RoHS; Manufacturer: ECT; Manufacturer Part Number: ECT818000071; Case/Package: SMD; Supplier-1: LCSC
R?#10-R?#12 R?#14 = RES_10K-0.05W-1%-0201: as R?#1 on sheet [1]-LPDDR4 SDRAM-1; Case/Package: 0201; Supplier-1: Digikey
R?#13 = RES_40.2K-0.05W-1%-0201: 40.2 kOhms ±1% 0.05W, 1/20W Chip Resistor 0201 (0603 Metric) Automotive AEC-Q200, Moisture Resistant Thick Film /; Manufacturer: Yageo; Manufacturer Part Number: AC0201FR-0740K2L; Case/Package: 0201; Supplier-1: Digikey
R?#15 = RES_1K-0.05W-1%-0201: 1 kOhms ±1% 0.05W, 1/20W Chip Resistor 0201 (0603 Metric) Thick Film /; Manufacturer: Yageo; Manufacturer Part Number: RC0201FR-071KL; Case/Package: 0201; Supplier-1: Digikey
U?#6 = IC_TXB0108NMER: Translation - Voltage Levels 8-Bit Bidirectional Voltage-Level Shifter with Auto Direction Sensing and +/-15-kV ESD Protect; Manufacturer: Texas Instruments; Manufacturer Part Number: TXB0108NMER; Case/Package: NFBGA-20; Supplier-1: Mouser
U?#7 = MOD_WF60-SMD: Amp’ed RF Tech presents the WF60 WiFi dual / band module: 802.11abgn.; Nymble Part Number: 1EA-AA-0568; Alternate Part Number-1: NA; Manufacturer: Amp’ed; Manufacturer Part Number: WF60; Case/Package: SMD; Supplier-1: Arrow; Supplier Part Number-1: WF60; Category: Module; Number of Pins: 16
U?#8 = REG_1.8V-300mA-5.5V-SC70-5: Linear Voltage Regulator IC 1 Output 300mA SC-70-5; Manufacturer: Richtek USA Inc.; Manufacturer Part Number: RT9193-18GU5; Case/Package: SC70-5; Supplier-1: Digikey
U?#9 = REG_5.5V-0~5.1V-0.5A-2.55W-DFN-6: Adjustable 5.5V 0.8V 500mA DFN-6 Linear Voltage Regulators RoHS; Manufacturer: STMicroelectronics; Nymble Part Number: 1EA-AA-0572; Alternate Part Number-1: NA; Manufacturer Part Number: LD39050PUR; Case/Package: DFN-6; Supplier-1: LCSC; Supplier Part Number-1: C222094; Category: Regulators; Number of Pins: 6
Y? = XTAL_ECS-327MVATX-2-CN-TR: 32.768kHz XO (Standard) CMOS Oscillator 1.6V ~ 3.6V Enable/Disable 4-SMD, No Lead; Manufacturer: ECS INC; Nymble Part Number: 1EA-AA-0561; Alternate Part Number-1: NA; Manufacturer Part Number: ECS-327MVATX-3-CN-TR; Case/Package: SMD-4; Supplier-1: Digikey; Supplier Part Number-1: ECS-327MVATX-3-CN-TR; Category: Crystal; Number of Pins: 4

## Sheet [5]-Block Diagram of SOM.SchDoc
size A4

## Sheet [6]-Power Pins Page of RK3399.SchDoc
size A3; Organization: Altium Limited; Address1: L3, 12a Rodborough Rd; Address2: Frenchs Forest; Address3: NSW; Address4: Australia 2086
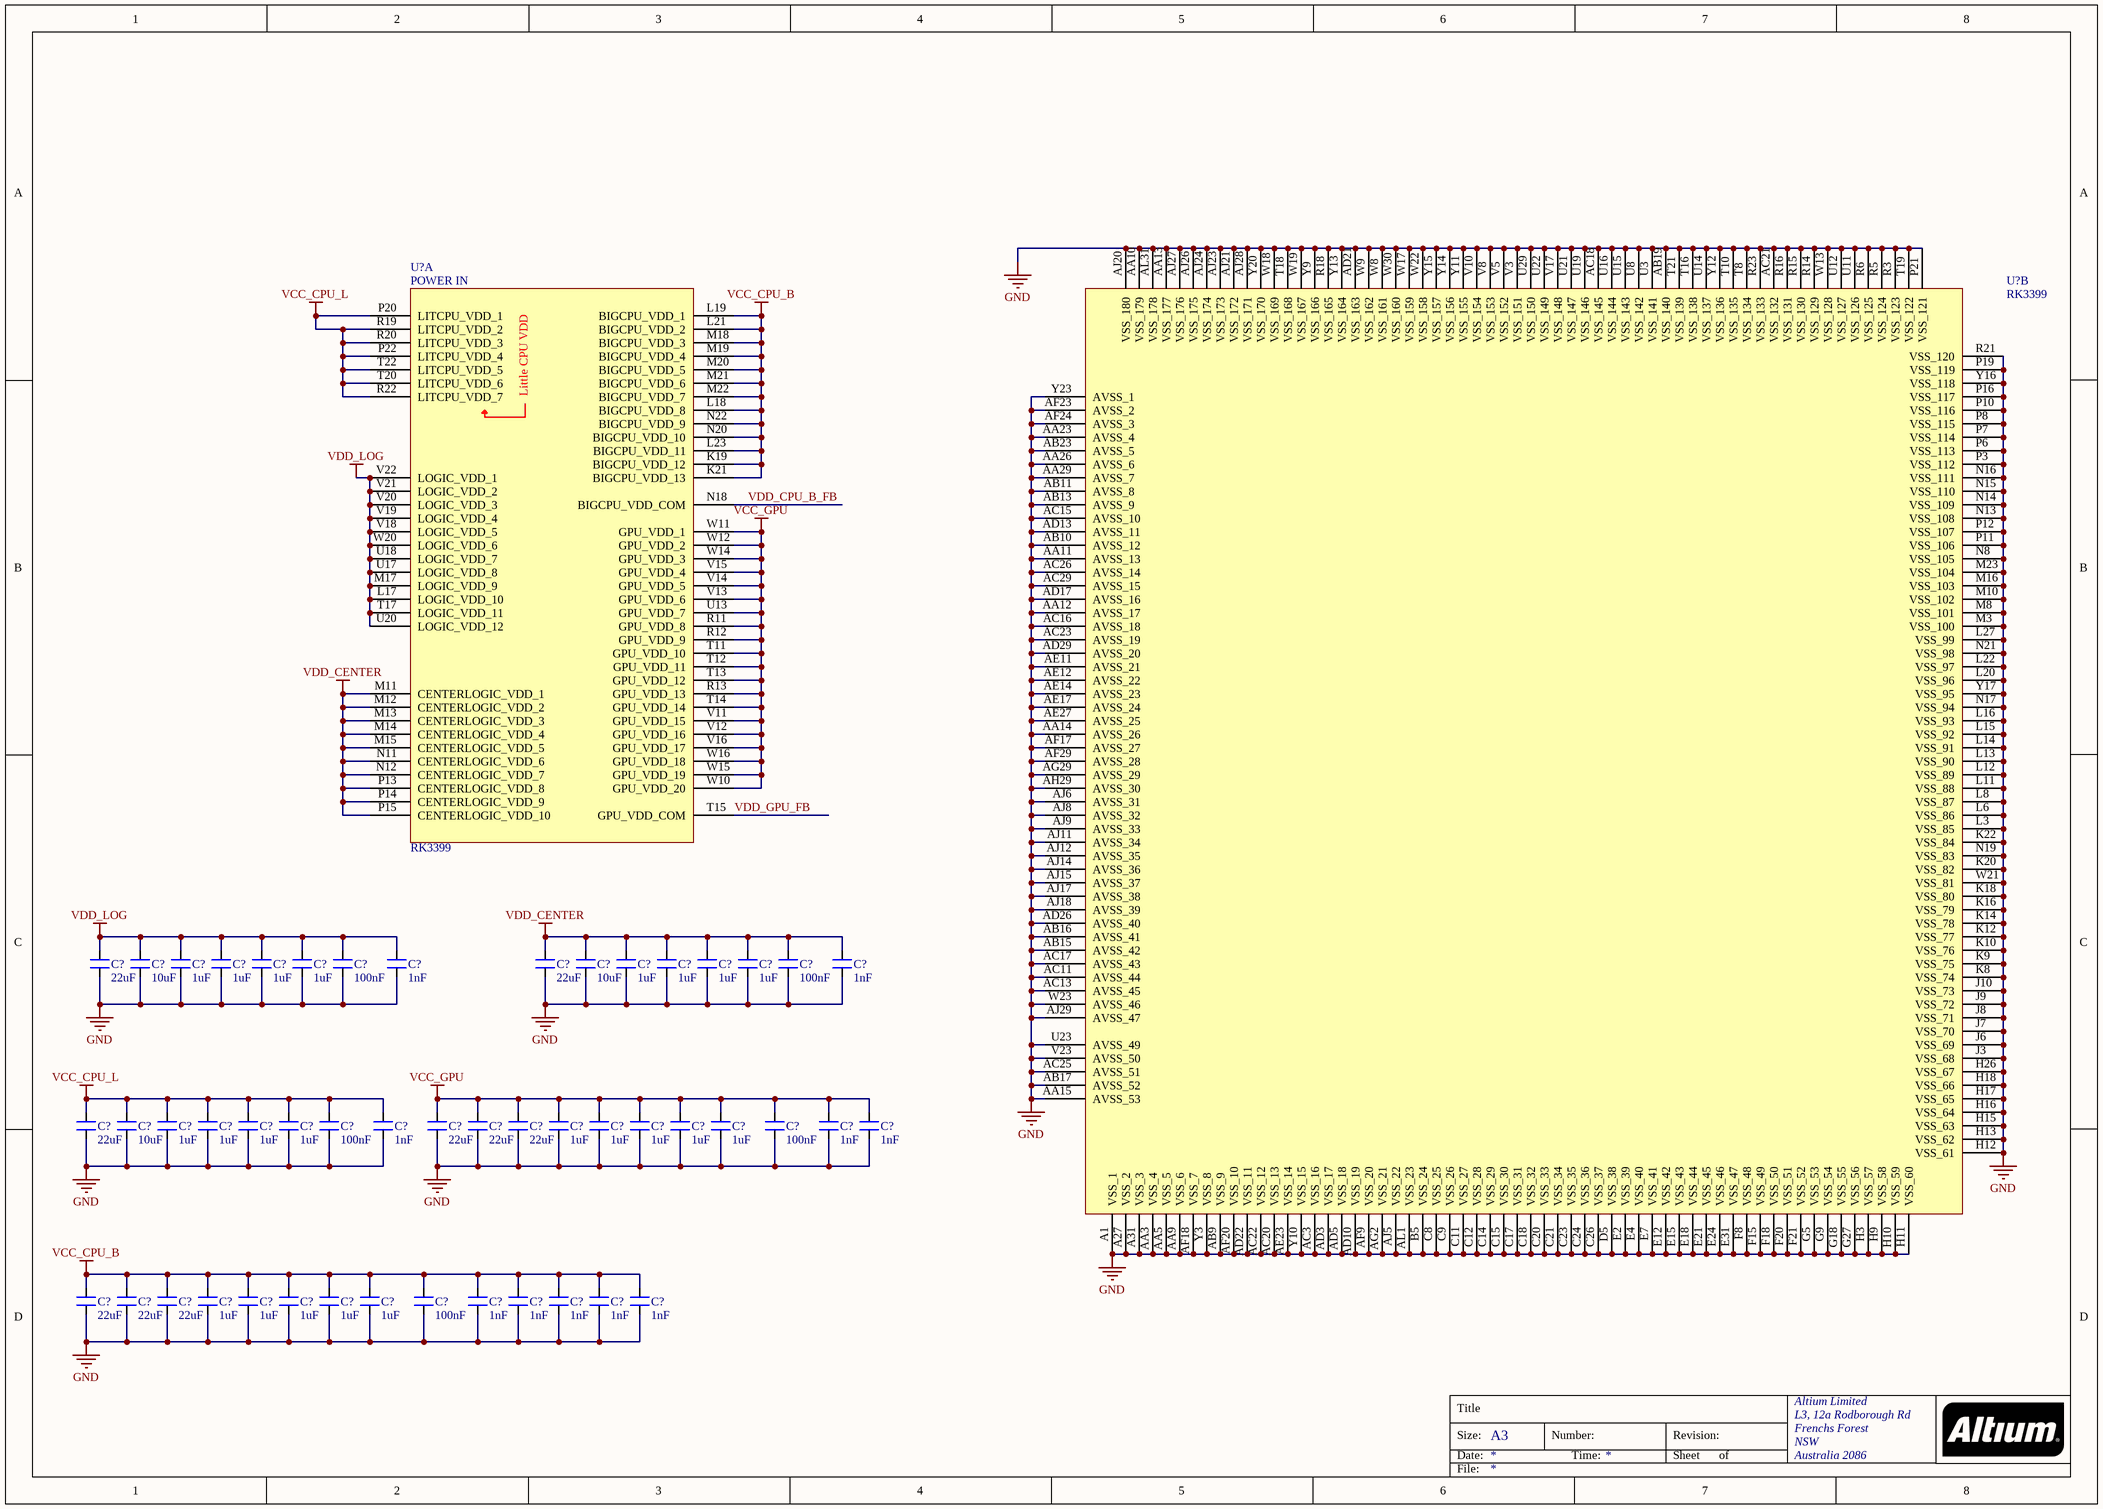
[diagram p4: [6]-Power Pins Page of RK3399.SchDoc]

### Parts
(Parts that share a designator on the sheet are numbered #1, #2 ... from top to bottom, then left to right.)
C?#120  22uF  [CAP_0603]
C?#121  10uF  [CAP_0603]
C?#122  1uF  [CAP_0201]
C?#123  1uF  [CAP_0201]
C?#124  1uF  [CAP_0201]
C?#125  1uF  [CAP_0201]
C?#126  100nF  [CAP_0201]
C?#127  1nF  [CAP_0201]
C?#128  22uF  [CAP_0603]
C?#129  10uF  [CAP_0603]
C?#130  1uF  [CAP_0201]
C?#131  1uF  [CAP_0201]
C?#132  1uF  [CAP_0201]
C?#133  1uF  [CAP_0201]
C?#134  100nF  [CAP_0201]
C?#135  1nF  [CAP_0201]
C?#136  22uF  [CAP_0603]
C?#137  10uF  [CAP_0603]
C?#138  1uF  [CAP_0201]
C?#139  1uF  [CAP_0201]
C?#140  1uF  [CAP_0201]
C?#141  1uF  [CAP_0201]
C?#142  100nF  [CAP_0201]
C?#143  1nF  [CAP_0201]
C?#144  22uF  [CAP_0603]
C?#145  22uF  [CAP_0603]
C?#146  22uF  [CAP_0603]
C?#147  1uF  [CAP_0201]
C?#148  1uF  [CAP_0201]
C?#149  1uF  [CAP_0201]
C?#150  1uF  [CAP_0201]
C?#151  1uF  [CAP_0201]
C?#152  100nF  [CAP_0201]
C?#153  1nF  [CAP_0201]
C?#154  1nF  [CAP_0201]
C?#155  22uF  [CAP_0603]
C?#156  22uF  [CAP_0603]
C?#157  22uF  [CAP_0603]
C?#158  1uF  [CAP_0201]
C?#159  1uF  [CAP_0201]
C?#160  1uF  [CAP_0201]
C?#161  1uF  [CAP_0201]
C?#162  1uF  [CAP_0201]
C?#163  100nF  [CAP_0201]
C?#164  1nF  [CAP_0201]
C?#165  1nF  [CAP_0201]
C?#166  1nF  [CAP_0201]
C?#167  1nF  [CAP_0201]
C?#168  1nF  [CAP_0201]
U?#10  RK3399  [FBGA828_23_826X826]  (part A of 24)
U?#11  RK3399  [FBGA828_23_826X826]  (part B of 24)

### Nets
GND: C?#120.1 C?#121.1 C?#122.1 C?#123.1 C?#124.1 C?#125.1 C?#126.1 C?#127.1 C?#128.1 C?#129.1 C?#130.1 C?#131.1 C?#132.1 C?#133.1 C?#134.1 C?#135.1 C?#136.1 C?#137.1 C?#138.1 C?#139.1 C?#140.1 C?#141.1 C?#142.1 C?#143.1 C?#144.1 C?#145.1 C?#146.1 C?#147.1 C?#148.1 C?#149.1 C?#150.1 C?#151.1 C?#152.1 C?#153.1 C?#154.1 C?#155.1 C?#156.1 C?#157.1 C?#158.1 C?#159.1 C?#160.1 C?#161.1 C?#162.1 C?#163.1 C?#164.1 C?#165.1 C?#166.1 C?#167.1 C?#168.1 U?#11.A1(VSS_1) U?#11.A27(VSS_2) U?#11.A31(VSS_3) U?#11.AA3(VSS_4) U?#11.AA5(VSS_5) U?#11.AA9(VSS_6) U?#11.AA10(VSS_179) U?#11.AA11(AVSS_13) U?#11.AA12(AVSS_17) U?#11.AA13(VSS_177) U?#11.AA14(AVSS_26) U?#11.AA15(AVSS_53) U?#11.AA23(AVSS_4) U?#11.AA26(AVSS_6) U?#11.AA29(AVSS_7) U?#11.AB9(VSS_9) U?#11.AB10(AVSS_12) U?#11.AB11(AVSS_8) U?#11.AB13(AVSS_9) U?#11.AB15(AVSS_42) U?#11.AB16(AVSS_41) U?#11.AB17(AVSS_52) U?#11.AB19(VSS_140) U?#11.AB23(AVSS_5) U?#11.AC3(VSS_16) U?#11.AC11(AVSS_44) U?#11.AC13(AVSS_45) U?#11.AC15(AVSS_10) U?#11.AC16(AVSS_18) U?#11.AC17(AVSS_43) U?#11.AC18(VSS_145) U?#11.AC20(VSS_13) U?#11.AC21(VSS_132) U?#11.AC22(VSS_12) U?#11.AC23(AVSS_19) U?#11.AC25(AVSS_51) U?#11.AC26(AVSS_14) U?#11.AC29(AVSS_15) U?#11.AD3(VSS_17) U?#11.AD5(VSS_18) U?#11.AD10(VSS_19) U?#11.AD13(AVSS_11) U?#11.AD17(AVSS_16) U?#11.AD21(VSS_163) U?#11.AD22(VSS_11) U?#11.AD26(AVSS_40) U?#11.AD29(AVSS_20) U?#11.AE11(AVSS_21) U?#11.AE12(AVSS_22) U?#11.AE14(AVSS_23) U?#11.AE17(AVSS_24) U?#11.AE23(VSS_14) U?#11.AE27(AVSS_25) U?#11.AF9(VSS_20) U?#11.AF17(AVSS_27) U?#11.AF18(VSS_7) U?#11.AF20(VSS_10) U?#11.AF23(AVSS_2) U?#11.AF24(AVSS_3) U?#11.AF29(AVSS_28) U?#11.AG2(VSS_21) U?#11.AG29(AVSS_29) U?#11.AH29(AVSS_30) U?#11.AJ5(VSS_22) U?#11.AJ6(AVSS_31) U?#11.AJ8(AVSS_32) U?#11.AJ9(AVSS_33) U?#11.AJ11(AVSS_34) U?#11.AJ12(AVSS_35) U?#11.AJ14(AVSS_36) U?#11.AJ15(AVSS_37) U?#11.AJ17(AVSS_38) U?#11.AJ18(AVSS_39) U?#11.AJ20(VSS_180) U?#11.AJ21(VSS_172) U?#11.AJ23(VSS_173) U?#11.AJ24(VSS_174) U?#11.AJ26(VSS_175) U?#11.AJ27(VSS_176) U?#11.AJ28(VSS_171) U?#11.AJ29(AVSS_47) U?#11.AL1(VSS_23) U?#11.AL31(VSS_178) U?#11.B5(VSS_24) U?#11.C8(VSS_25) U?#11.C9(VSS_26) U?#11.C11(VSS_27) U?#11.C12(VSS_28) U?#11.C14(VSS_29) U?#11.C15(VSS_30) U?#11.C17(VSS_31) U?#11.C18(VSS_32) U?#11.C20(VSS_33) U?#11.C21(VSS_34) U?#11.C23(VSS_35) U?#11.C24(VSS_36) U?#11.C26(VSS_37) U?#11.D5(VSS_38) U?#11.E2(VSS_39) U?#11.E4(VSS_40) U?#11.E7(VSS_41) U?#11.E12(VSS_42) U?#11.E15(VSS_43) U?#11.E18(VSS_44) U?#11.E21(VSS_45) U?#11.E24(VSS_46) U?#11.E31(VSS_47) U?#11.F8(VSS_48) U?#11.F15(VSS_49) U?#11.F18(VSS_50) U?#11.F20(VSS_51) U?#11.F21(VSS_52) U?#11.G5(VSS_53) U?#11.G9(VSS_54) U?#11.G18(VSS_55) U?#11.G27(VSS_56) U?#11.H3(VSS_57) U?#11.H9(VSS_58) U?#11.H10(VSS_59) U?#11.H11(VSS_60) U?#11.H12(VSS_61) U?#11.H13(VSS_62) U?#11.H15(VSS_63) U?#11.H16(VSS_64) U?#11.H17(VSS_65) U?#11.H18(VSS_66) U?#11.H26(VSS_67) U?#11.J3(VSS_68) U?#11.J6(VSS_69) U?#11.J7(VSS_70) U?#11.J8(VSS_71) U?#11.J9(VSS_72) U?#11.J10(VSS_73) U?#11.K8(VSS_74) U?#11.K9(VSS_75) U?#11.K10(VSS_76) U?#11.K12(VSS_77) U?#11.K14(VSS_78) U?#11.K16(VSS_79) U?#11.K18(VSS_80) U?#11.K20(VSS_82) U?#11.K22(VSS_84) U?#11.L3(VSS_85) U?#11.L6(VSS_86) U?#11.L8(VSS_87) U?#11.L11(VSS_88) U?#11.L12(VSS_89) U?#11.L13(VSS_90) U?#11.L14(VSS_91) U?#11.L15(VSS_92) U?#11.L16(VSS_93) U?#11.L20(VSS_96) U?#11.L22(VSS_97) U?#11.L27(VSS_99) U?#11.M3(VSS_100) U?#11.M8(VSS_101) U?#11.M10(VSS_102) U?#11.M16(VSS_103) U?#11.M23(VSS_104) U?#11.N8(VSS_105) U?#11.N13(VSS_108) U?#11.N14(VSS_109) U?#11.N15(VSS_110) U?#11.N16(VSS_111) U?#11.N17(VSS_94) U?#11.N19(VSS_83) U?#11.N21(VSS_98) U?#11.P3(VSS_112) U?#11.P6(VSS_113) U?#11.P7(VSS_114) U?#11.P8(VSS_115) U?#11.P10(VSS_116) U?#11.P11(VSS_106) U?#11.P12(VSS_107) U?#11.P16(VSS_117) U?#11.P19(VSS_119) U?#11.P21(VSS_121) U?#11.R3(VSS_123) U?#11.R5(VSS_124) U?#11.R6(VSS_125) U?#11.R14(VSS_129) U?#11.R15(VSS_130) U?#11.R16(VSS_131) U?#11.R18(VSS_165) U?#11.R21(VSS_120) U?#11.R23(VSS_133) U?#11.T8(VSS_134) U?#11.T10(VSS_135) U?#11.T16(VSS_138) U?#11.T18(VSS_168) U?#11.T19(VSS_122) U?#11.T21(VSS_139) U?#11.U3(VSS_141) U?#11.U8(VSS_142) U?#11.U11(VSS_126) U?#11.U12(VSS_127) U?#11.U14(VSS_137) U?#11.U15(VSS_143) U?#11.U16(VSS_144) U?#11.U19(VSS_146) U?#11.U21(VSS_147) U?#11.U22(VSS_149) U?#11.U23(AVSS_49) U?#11.U29(VSS_150) U?#11.V3(VSS_151) U?#11.V5(VSS_152) U?#11.V8(VSS_153) U?#11.V10(VSS_154) U?#11.V17(VSS_148) U?#11.V23(AVSS_50) U?#11.W8(VSS_161) U?#11.W9(VSS_162) U?#11.W13(VSS_128) U?#11.W17(VSS_159) U?#11.W18(VSS_169) U?#11.W19(VSS_167) U?#11.W21(VSS_81) U?#11.W22(VSS_158) U?#11.W23(AVSS_46) U?#11.W30(VSS_160) U?#11.Y3(VSS_8) U?#11.Y9(VSS_166) U?#11.Y10(VSS_15) U?#11.Y11(VSS_155) U?#11.Y12(VSS_136) U?#11.Y13(VSS_164) U?#11.Y14(VSS_156) U?#11.Y15(VSS_157) U?#11.Y16(VSS_118) U?#11.Y17(VSS_95) U?#11.Y20(VSS_170) U?#11.Y23(AVSS_1)
VCC_CPU_B: C?#155.2 C?#156.2 C?#157.2 C?#158.2 C?#159.2 C?#160.2 C?#161.2 C?#162.2 C?#163.2 C?#164.2 C?#165.2 C?#166.2 C?#167.2 C?#168.2 U?#10.K19(BIGCPU_VDD_12) U?#10.K21(BIGCPU_VDD_13) U?#10.L18(BIGCPU_VDD_8) U?#10.L19(BIGCPU_VDD_1) U?#10.L21(BIGCPU_VDD_2) U?#10.L23(BIGCPU_VDD_11) U?#10.M18(BIGCPU_VDD_3) U?#10.M19(BIGCPU_VDD_4) U?#10.M20(BIGCPU_VDD_5) U?#10.M21(BIGCPU_VDD_6) U?#10.M22(BIGCPU_VDD_7) U?#10.N20(BIGCPU_VDD_10) U?#10.N22(BIGCPU_VDD_9)
VCC_CPU_L: C?#136.2 C?#137.2 C?#138.2 C?#139.2 C?#140.2 C?#141.2 C?#142.2 C?#143.2 U?#10.P20(LITCPU_VDD_1) U?#10.P22(LITCPU_VDD_4) U?#10.R19(LITCPU_VDD_2) U?#10.R20(LITCPU_VDD_3) U?#10.R22(LITCPU_VDD_7) U?#10.T20(LITCPU_VDD_6) U?#10.T22(LITCPU_VDD_5)
VCC_GPU: C?#144.2 C?#145.2 C?#146.2 C?#147.2 C?#148.2 C?#149.2 C?#150.2 C?#151.2 C?#152.2 C?#153.2 C?#154.2 U?#10.R11(GPU_VDD_8) U?#10.R12(GPU_VDD_9) U?#10.R13(GPU_VDD_13) U?#10.T11(GPU_VDD_10) U?#10.T12(GPU_VDD_11) U?#10.T13(GPU_VDD_12) U?#10.T14(GPU_VDD_14) U?#10.U13(GPU_VDD_7) U?#10.V11(GPU_VDD_15) U?#10.V12(GPU_VDD_16) U?#10.V13(GPU_VDD_6) U?#10.V14(GPU_VDD_5) U?#10.V15(GPU_VDD_4) U?#10.V16(GPU_VDD_17) U?#10.W10(GPU_VDD_20) U?#10.W11(GPU_VDD_1) U?#10.W12(GPU_VDD_2) U?#10.W14(GPU_VDD_3) U?#10.W15(GPU_VDD_19) U?#10.W16(GPU_VDD_18)
VDD_CENTER: C?#128.2 C?#129.2 C?#130.2 C?#131.2 C?#132.2 C?#133.2 C?#134.2 C?#135.2 U?#10.M11(CENTERLOGIC_VDD_1) U?#10.M12(CENTERLOGIC_VDD_2) U?#10.M13(CENTERLOGIC_VDD_3) U?#10.M14(CENTERLOGIC_VDD_4) U?#10.M15(CENTERLOGIC_VDD_5) U?#10.N11(CENTERLOGIC_VDD_6) U?#10.N12(CENTERLOGIC_VDD_7) U?#10.P13(CENTERLOGIC_VDD_8) U?#10.P14(CENTERLOGIC_VDD_9) U?#10.P15(CENTERLOGIC_VDD_10)
VDD_LOG: C?#120.2 C?#121.2 C?#122.2 C?#123.2 C?#124.2 C?#125.2 C?#126.2 C?#127.2 U?#10.L17(LOGIC_VDD_10) U?#10.M17(LOGIC_VDD_9) U?#10.T17(LOGIC_VDD_11) U?#10.U17(LOGIC_VDD_8) U?#10.U18(LOGIC_VDD_7) U?#10.U20(LOGIC_VDD_12) U?#10.V18(LOGIC_VDD_5) U?#10.V19(LOGIC_VDD_4) U?#10.V20(LOGIC_VDD_3) U?#10.V21(LOGIC_VDD_2) U?#10.V22(LOGIC_VDD_1) U?#10.W20(LOGIC_VDD_6)
VDD_CPU_B_FB: U?#10.N18(BIGCPU_VDD_COM)
VDD_GPU_FB: U?#10.T15(GPU_VDD_COM)

### Notes on the sheet
- Title
- Size:
- Date:
- A3
- Number:
- Time:
- Revision:
- Sheet
- of
- File:
- (in symbol IC_RK3399-FCBGA828, part A) POWER IN; Little CPU VDD

### Library data of the parts
C?#120 C?#128 C?#136 C?#144-C?#146 C?#155-C?#157 = CAP_22uF-10V-20%-0603: as C?#1 on sheet [1]-LPDDR4 SDRAM-1; Case/Package: 0603; Supplier-1: Digikey
C?#121 C?#129 C?#137 = CAP_10uF-10V-10%-0603: as C?#2 on sheet [1]-LPDDR4 SDRAM-1; Case/Package: 0603; Supplier-1: Digikey
C?#122-C?#125 C?#130-C?#133 C?#138-C?#141 C?#147-C?#151 C?#158-C?#162 = CAP_1uF-16V-10%-0201: as C?#116 on sheet [4]-WIFI Module WF60; Case/Package: 0201; Supplier-1: Digikey
C?#126 C?#134 C?#142 C?#152 C?#163 = CAP_100nF-25V-10%-0201: as C?#3 on sheet [1]-LPDDR4 SDRAM-1; Case/Package: 0201; Supplier-1: Digikey
C?#127 C?#135 C?#143 C?#153 C?#154 C?#164-C?#168 = CAP_1nF-16V-10%-0201: 1000pF ±10% 16V Ceramic Capacitor X7R 0201 (0603 Metric) /; Manufacturer: Murata Electronics; Manufacturer Part Number: GRM033R71C102KA01D; Case/Package: 0201; Supplier-1: Digikey
U?#10 U?#11 = IC_RK3399-FCBGA828: RK3399 is a low power, high performance processor for computing, personal mobile.; Manufacturer: Rockchip; Manufacturer Part Number: RK3399; Case/Package: FCBGA828; Supplier-1: Rockchip

## Sheet [7]-RK3399 SDRAM Page.SchDoc
size A3; Organization: Altium Limited; Address1: L3, 12a Rodborough Rd; Address2: Frenchs Forest; Address3: NSW; Address4: Australia 2086
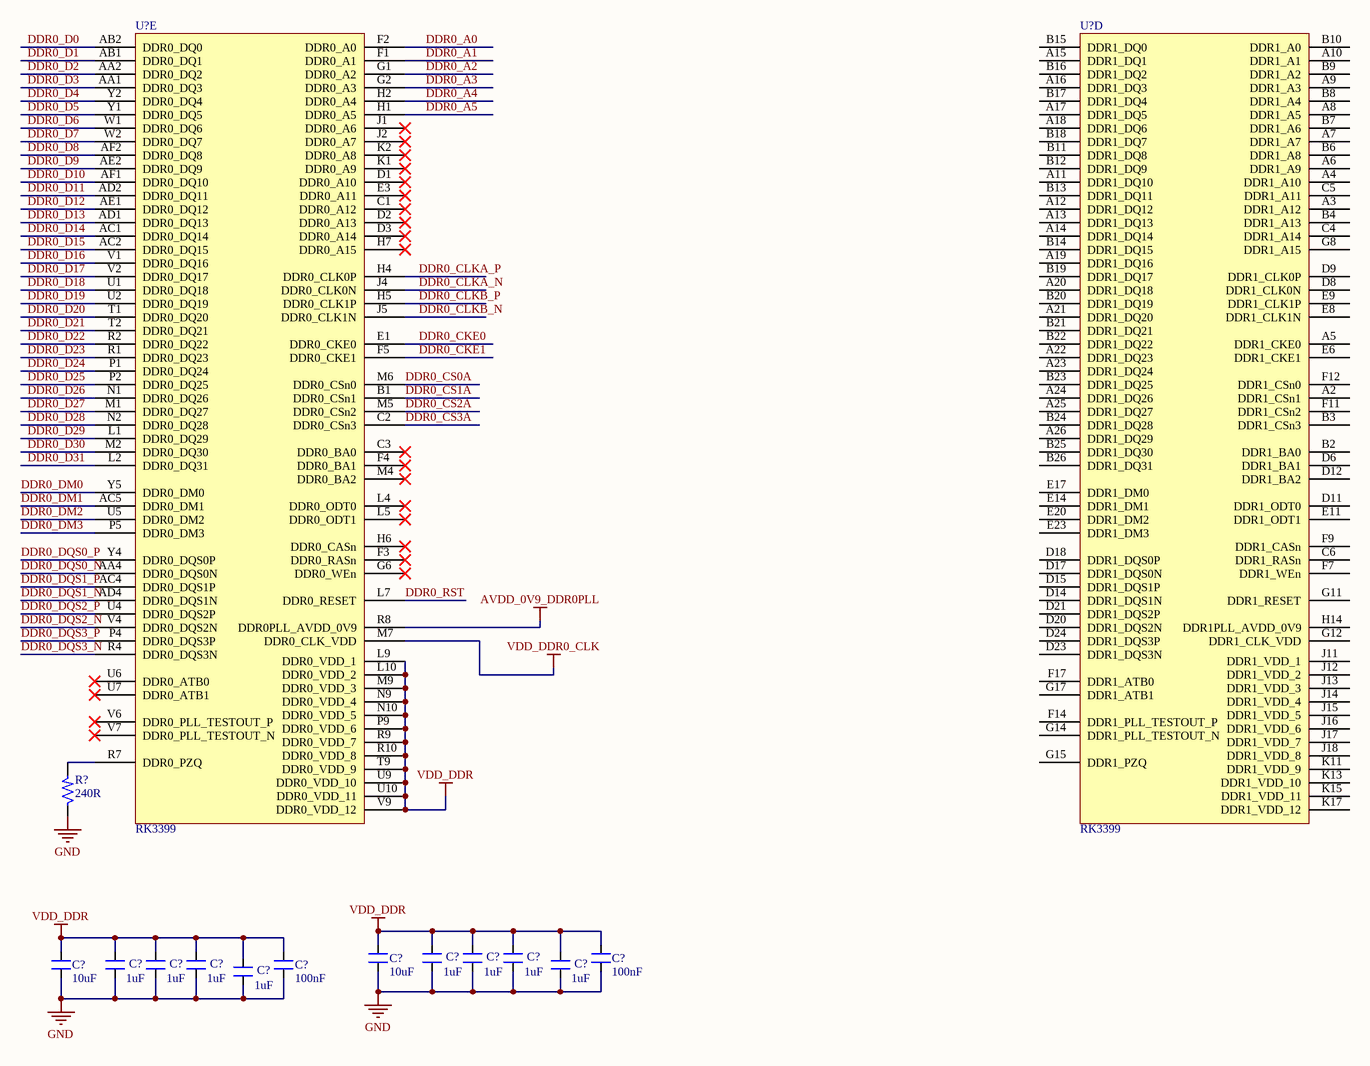
[diagram p5: [7]-RK3399 SDRAM Page.SchDoc]

### Parts
(Parts that share a designator on the sheet are numbered #1, #2 ... from top to bottom, then left to right.)
C?#169  10uF  [CAP_0603]
C?#170  1uF  [CAP_0402]
C?#171  1uF  [CAP_0402]
C?#172  1uF  [CAP_0402]
C?#173  100nF  [CAP_0201]
C?#174  10uF  [CAP_0603]
C?#175  1uF  [CAP_0402]
C?#176  1uF  [CAP_0402]
C?#177  1uF  [CAP_0402]
C?#178  100nF  [CAP_0201]
C?#179  1uF  [CAP_0402]
C?#180  1uF  [CAP_0402]
R?#16  240R  [RES_0201]
U?#12  RK3399  [FBGA828_23_826X826]  (part E of 24)
U?#13  RK3399  [FBGA828_23_826X826]  (part D of 24)

### Nets
AVDD_0V9_DDR0PLL: U?#12.R8(DDR0PLL_AVDD_0V9)
GND: C?#169.1 C?#170.1 C?#171.1 C?#172.1 C?#173.1 C?#174.1 C?#175.1 C?#176.1 C?#177.1 C?#178.1 C?#179.1 C?#180.1 R?#16.1
VDD_DDR: C?#169.2 C?#170.2 C?#171.2 C?#172.2 C?#173.2 C?#174.2 C?#175.2 C?#176.2 C?#177.2 C?#178.2 C?#179.2 C?#180.2 U?#12.L9(DDR0_VDD_1) U?#12.L10(DDR0_VDD_2) U?#12.M9(DDR0_VDD_3) U?#12.N9(DDR0_VDD_4) U?#12.N10(DDR0_VDD_5) U?#12.P9(DDR0_VDD_6) U?#12.R9(DDR0_VDD_7) U?#12.R10(DDR0_VDD_8) U?#12.T9(DDR0_VDD_9) U?#12.U9(DDR0_VDD_10) U?#12.U10(DDR0_VDD_11) U?#12.V9(DDR0_VDD_12)
VDD_DDR0_CLK: U?#12.M7(DDR0_CLK_VDD)
DDR0_A0: U?#12.F2(DDR0_A0)
DDR0_A1: U?#12.F1(DDR0_A1)
DDR0_A2: U?#12.G1(DDR0_A2)
DDR0_A3: U?#12.G2(DDR0_A3)
DDR0_A4: U?#12.H2(DDR0_A4)
DDR0_A5: U?#12.H1(DDR0_A5)
DDR0_CKE0: U?#12.E1(DDR0_CKE0)
DDR0_CKE1: U?#12.F5(DDR0_CKE1)
DDR0_CLKA_N: U?#12.J4(DDR0_CLK0N)
DDR0_CLKA_P: U?#12.H4(DDR0_CLK0P)
DDR0_CLKB_N: U?#12.J5(DDR0_CLK1N)
DDR0_CLKB_P: U?#12.H5(DDR0_CLK1P)
DDR0_CS0A: U?#12.M6(DDR0_CSn0)
DDR0_CS1A: U?#12.B1(DDR0_CSn1)
DDR0_CS2A: U?#12.M5(DDR0_CSn2)
DDR0_CS3A: U?#12.C2(DDR0_CSn3)
DDR0_D0: U?#12.AB2(DDR0_DQ0)
DDR0_D1: U?#12.AB1(DDR0_DQ1)
DDR0_D2: U?#12.AA2(DDR0_DQ2)
DDR0_D3: U?#12.AA1(DDR0_DQ3)
DDR0_D4: U?#12.Y2(DDR0_DQ4)
DDR0_D5: U?#12.Y1(DDR0_DQ5)
DDR0_D6: U?#12.W1(DDR0_DQ6)
DDR0_D7: U?#12.W2(DDR0_DQ7)
DDR0_D8: U?#12.AF2(DDR0_DQ8)
DDR0_D9: U?#12.AE2(DDR0_DQ9)
DDR0_D10: U?#12.AF1(DDR0_DQ10)
DDR0_D11: U?#12.AD2(DDR0_DQ11)
DDR0_D12: U?#12.AE1(DDR0_DQ12)
DDR0_D13: U?#12.AD1(DDR0_DQ13)
DDR0_D14: U?#12.AC1(DDR0_DQ14)
DDR0_D15: U?#12.AC2(DDR0_DQ15)
DDR0_D16: U?#12.V1(DDR0_DQ16)
DDR0_D17: U?#12.V2(DDR0_DQ17)
DDR0_D18: U?#12.U1(DDR0_DQ18)
DDR0_D19: U?#12.U2(DDR0_DQ19)
DDR0_D20: U?#12.T1(DDR0_DQ20)
DDR0_D21: U?#12.T2(DDR0_DQ21)
DDR0_D22: U?#12.R2(DDR0_DQ22)
DDR0_D23: U?#12.R1(DDR0_DQ23)
DDR0_D24: U?#12.P1(DDR0_DQ24)
DDR0_D25: U?#12.P2(DDR0_DQ25)
DDR0_D26: U?#12.N1(DDR0_DQ26)
DDR0_D27: U?#12.M1(DDR0_DQ27)
DDR0_D28: U?#12.N2(DDR0_DQ28)
DDR0_D29: U?#12.L1(DDR0_DQ29)
DDR0_D30: U?#12.M2(DDR0_DQ30)
DDR0_D31: U?#12.L2(DDR0_DQ31)
DDR0_DM0: U?#12.Y5(DDR0_DM0)
DDR0_DM1: U?#12.AC5(DDR0_DM1)
DDR0_DM2: U?#12.U5(DDR0_DM2)
DDR0_DM3: U?#12.P5(DDR0_DM3)
DDR0_DQS0_N: U?#12.AA4(DDR0_DQS0N)
DDR0_DQS0_P: U?#12.Y4(DDR0_DQS0P)
DDR0_DQS1_N: U?#12.AD4(DDR0_DQS1N)
DDR0_DQS1_P: U?#12.AC4(DDR0_DQS1P)
DDR0_DQS2_N: U?#12.V4(DDR0_DQS2N)
DDR0_DQS2_P: U?#12.U4(DDR0_DQS2P)
DDR0_DQS3_N: U?#12.R4(DDR0_DQS3N)
DDR0_DQS3_P: U?#12.P4(DDR0_DQS3P)
DDR0_RST: U?#12.L7(DDR0_RESET)
NetR?#16_2: R?#16.2 U?#12.R7(DDR0_PZQ)

Not connected (* = marked no-connect by the designer): U?#12 C1(DDR0_A12)* C3(DDR0_BA0)* D1(DDR0_A10)* D2(DDR0_A13)* D3(DDR0_A14)* E3(DDR0_A11)* F3(DDR0_RASn)* F4(DDR0_BA1)* G6(DDR0_WEn)* H6(DDR0_CASn)* H7(DDR0_A15)* J1(DDR0_A6)* J2(DDR0_A7)* K1(DDR0_A9)* K2(DDR0_A8)* L4(DDR0_ODT0)* L5(DDR0_ODT1)* M4(DDR0_BA2)* U6(DDR0_ATB0)* U7(DDR0_ATB1)* V6(DDR0_PLL_TESTOUT_P)* V7(DDR0_PLL_TESTOUT_N)*; U?#13 A2(DDR1_CSn1) A3(DDR1_A12) A4(DDR1_A10) A5(DDR1_CKE0) A6(DDR1_A9) A7(DDR1_A7) A8(DDR1_A5) A9(DDR1_A3) A10(DDR1_A1) A11(DDR1_DQ10) A12(DDR1_DQ12) A13(DDR1_DQ13) A14(DDR1_DQ14) A15(DDR1_DQ1) A16(DDR1_DQ3) A17(DDR1_DQ5) A18(DDR1_DQ6) A19(DDR1_DQ16) A20(DDR1_DQ18) A21(DDR1_DQ20) A22(DDR1_DQ23) A23(DDR1_DQ24) A24(DDR1_DQ26) A25(DDR1_DQ27) A26(DDR1_DQ29) B2(DDR1_BA0) B3(DDR1_CSn3) B4(DDR1_A13) B6(DDR1_A8) B7(DDR1_A6) B8(DDR1_A4) B9(DDR1_A2) B10(DDR1_A0) B11(DDR1_DQ8) B12(DDR1_DQ9) B13(DDR1_DQ11) B14(DDR1_DQ15) B15(DDR1_DQ0) B16(DDR1_DQ2) B17(DDR1_DQ4) B18(DDR1_DQ7) B19(DDR1_DQ17) B20(DDR1_DQ19) B21(DDR1_DQ21) B22(DDR1_DQ22) B23(DDR1_DQ25) B24(DDR1_DQ28) B25(DDR1_DQ30) B26(DDR1_DQ31) C4(DDR1_A14) C5(DDR1_A11) C6(DDR1_RASn) D6(DDR1_BA1) D8(DDR1_CLK0N) D9(DDR1_CLK0P) D11(DDR1_ODT0) D12(DDR1_BA2) D14(DDR1_DQS1N) D15(DDR1_DQS1P) D17(DDR1_DQS0N) D18(DDR1_DQS0P) D20(DDR1_DQS2N) D21(DDR1_DQS2P) D23(DDR1_DQS3N) D24(DDR1_DQS3P) E6(DDR1_CKE1) E8(DDR1_CLK1N) E9(DDR1_CLK1P) E11(DDR1_ODT1) E14(DDR1_DM1) E17(DDR1_DM0) E20(DDR1_DM2) E23(DDR1_DM3) F7(DDR1_WEn) F9(DDR1_CASn) F11(DDR1_CSn2) F12(DDR1_CSn0) F14(DDR1_PLL_TESTOUT_P) F17(DDR1_ATB0) G8(DDR1_A15) G11(DDR1_RESET) G12(DDR1_CLK_VDD) G14(DDR1_PLL_TESTOUT_N) G15(DDR1_PZQ) G17(DDR1_ATB1) H14(DDR1PLL_AVDD_0V9) J11(DDR1_VDD_1) J12(DDR1_VDD_2) J13(DDR1_VDD_3) J14(DDR1_VDD_4) J15(DDR1_VDD_5) J16(DDR1_VDD_6) J17(DDR1_VDD_7) J18(DDR1_VDD_8) K11(DDR1_VDD_9) K13(DDR1_VDD_10) K15(DDR1_VDD_11) K17(DDR1_VDD_12)

### Notes on the sheet
- Title
- Size:
- Date:
- A3
- Number:
- Time:
- Revision:
- Sheet
- of
- File:

### Library data of the parts
C?#169 C?#174 = CAP_10uF-10V-10%-0603: as C?#2 on sheet [1]-LPDDR4 SDRAM-1; Case/Package: 0603; Supplier-1: Digikey
C?#170-C?#172 C?#175-C?#177 C?#179 C?#180 = CAP_1uF-10V-10%-0402: 1µF ±10% 10V Ceramic Capacitor X6S 0402 (1005 Metric) /; Manufacturer: Murata Electronics; Manufacturer Part Number: GRT155C81A105KE01D; Case/Package: 0402; Supplier-1: Digikey
C?#173 C?#178 = CAP_100nF-25V-10%-0201: as C?#3 on sheet [1]-LPDDR4 SDRAM-1; Case/Package: 0201; Supplier-1: Digikey
R?#16 = RES_240R-0.05W-1%-0201: as R?#2 on sheet [1]-LPDDR4 SDRAM-1; Case/Package: 0201; Supplier-1: Digikey
U?#12 U?#13 = IC_RK3399-FCBGA828: as U?#10 on sheet [6]-Power Pins Page of RK3399; Manufacturer Part Number: RK3399; Case/Package: FCBGA828; Supplier-1: Rockchip

## Nets that join several sheets
GND: [1]-LPDDR4 SDRAM-1 (107 pins), [2]-LPDDR4 SDRAM-2 (107 pins), [3]-EMMC Chip (23 pins), [4]-WIFI Module WF60 (26 pins), [6]-Power Pins Page of RK3399 (281 pins), [7]-RK3399 SDRAM Page (13 pins)
VDD1: [1]-LPDDR4 SDRAM-1 (27 pins), [2]-LPDDR4 SDRAM-2 (27 pins)
VDD2: [1]-LPDDR4 SDRAM-1 (34 pins), [2]-LPDDR4 SDRAM-2 (34 pins)
VDDQ: [1]-LPDDR4 SDRAM-1 (42 pins), [2]-LPDDR4 SDRAM-2 (42 pins)
DDR0_A0: [1]-LPDDR4 SDRAM-1 (U?#2.H2 U?#2.R2), [7]-RK3399 SDRAM Page (U?#12.F2)
DDR0_A1: [1]-LPDDR4 SDRAM-1 (U?#2.J2 U?#2.P2), [7]-RK3399 SDRAM Page (U?#12.F1)
DDR0_A2: [1]-LPDDR4 SDRAM-1 (U?#2.H9 U?#2.R9), [7]-RK3399 SDRAM Page (U?#12.G1)
DDR0_A3: [1]-LPDDR4 SDRAM-1 (U?#2.H10 U?#2.R10), [7]-RK3399 SDRAM Page (U?#12.G2)
DDR0_A4: [1]-LPDDR4 SDRAM-1 (U?#2.H11 U?#2.R11), [7]-RK3399 SDRAM Page (U?#12.H2)
DDR0_A5: [1]-LPDDR4 SDRAM-1 (U?#2.J11 U?#2.P11), [7]-RK3399 SDRAM Page (U?#12.H1)
DDR0_CKE0: [1]-LPDDR4 SDRAM-1 (U?#2.J4 U?#2.P4), [7]-RK3399 SDRAM Page (U?#12.E1)
DDR0_CKE1: [1]-LPDDR4 SDRAM-1 (U?#2.J5 U?#2.P5), [7]-RK3399 SDRAM Page (U?#12.F5)
DDR0_CLKA_N: [1]-LPDDR4 SDRAM-1 (U?#2.J9), [7]-RK3399 SDRAM Page (U?#12.J4)
DDR0_CLKA_P: [1]-LPDDR4 SDRAM-1 (U?#2.J8), [7]-RK3399 SDRAM Page (U?#12.H4)
DDR0_CLKB_N: [1]-LPDDR4 SDRAM-1 (U?#2.P9), [7]-RK3399 SDRAM Page (U?#12.J5)
DDR0_CLKB_P: [1]-LPDDR4 SDRAM-1 (U?#2.P8), [7]-RK3399 SDRAM Page (U?#12.H5)
DDR0_CS0A: [1]-LPDDR4 SDRAM-1 (U?#2.H4), [7]-RK3399 SDRAM Page (U?#12.M6)
DDR0_CS1A: [1]-LPDDR4 SDRAM-1 (U?#2.H3), [7]-RK3399 SDRAM Page (U?#12.B1)
DDR0_CS2A: [1]-LPDDR4 SDRAM-1 (U?#2.R4), [7]-RK3399 SDRAM Page (U?#12.M5)
DDR0_CS3A: [1]-LPDDR4 SDRAM-1 (U?#2.R3), [7]-RK3399 SDRAM Page (U?#12.C2)
DDR0_D0: [1]-LPDDR4 SDRAM-1 (U?#2.B2), [7]-RK3399 SDRAM Page (U?#12.AB2)
DDR0_D1: [1]-LPDDR4 SDRAM-1 (U?#2.C2), [7]-RK3399 SDRAM Page (U?#12.AB1)
DDR0_D2: [1]-LPDDR4 SDRAM-1 (U?#2.E2), [7]-RK3399 SDRAM Page (U?#12.AA2)
DDR0_D3: [1]-LPDDR4 SDRAM-1 (U?#2.F2), [7]-RK3399 SDRAM Page (U?#12.AA1)
DDR0_D4: [1]-LPDDR4 SDRAM-1 (U?#2.F4), [7]-RK3399 SDRAM Page (U?#12.Y2)
DDR0_D5: [1]-LPDDR4 SDRAM-1 (U?#2.E4), [7]-RK3399 SDRAM Page (U?#12.Y1)
DDR0_D6: [1]-LPDDR4 SDRAM-1 (U?#2.C4), [7]-RK3399 SDRAM Page (U?#12.W1)
DDR0_D7: [1]-LPDDR4 SDRAM-1 (U?#2.B4), [7]-RK3399 SDRAM Page (U?#12.W2)
DDR0_D8: [1]-LPDDR4 SDRAM-1 (U?#2.B11), [7]-RK3399 SDRAM Page (U?#12.AF2)
DDR0_D9: [1]-LPDDR4 SDRAM-1 (U?#2.C11), [7]-RK3399 SDRAM Page (U?#12.AE2)
DDR0_D10: [1]-LPDDR4 SDRAM-1 (U?#2.E11), [7]-RK3399 SDRAM Page (U?#12.AF1)
DDR0_D11: [1]-LPDDR4 SDRAM-1 (U?#2.F11), [7]-RK3399 SDRAM Page (U?#12.AD2)
DDR0_D12: [1]-LPDDR4 SDRAM-1 (U?#2.F9), [7]-RK3399 SDRAM Page (U?#12.AE1)
DDR0_D13: [1]-LPDDR4 SDRAM-1 (U?#2.E9), [7]-RK3399 SDRAM Page (U?#12.AD1)
DDR0_D14: [1]-LPDDR4 SDRAM-1 (U?#2.C9), [7]-RK3399 SDRAM Page (U?#12.AC1)
DDR0_D15: [1]-LPDDR4 SDRAM-1 (U?#2.B9), [7]-RK3399 SDRAM Page (U?#12.AC2)
DDR0_D16: [1]-LPDDR4 SDRAM-1 (U?#2.AA2), [7]-RK3399 SDRAM Page (U?#12.V1)
DDR0_D17: [1]-LPDDR4 SDRAM-1 (U?#2.Y2), [7]-RK3399 SDRAM Page (U?#12.V2)
DDR0_D18: [1]-LPDDR4 SDRAM-1 (U?#2.V2), [7]-RK3399 SDRAM Page (U?#12.U1)
DDR0_D19: [1]-LPDDR4 SDRAM-1 (U?#2.U2), [7]-RK3399 SDRAM Page (U?#12.U2)
DDR0_D20: [1]-LPDDR4 SDRAM-1 (U?#2.U4), [7]-RK3399 SDRAM Page (U?#12.T1)
DDR0_D21: [1]-LPDDR4 SDRAM-1 (U?#2.V4), [7]-RK3399 SDRAM Page (U?#12.T2)
DDR0_D22: [1]-LPDDR4 SDRAM-1 (U?#2.Y4), [7]-RK3399 SDRAM Page (U?#12.R2)
DDR0_D23: [1]-LPDDR4 SDRAM-1 (U?#2.AA4), [7]-RK3399 SDRAM Page (U?#12.R1)
DDR0_D24: [1]-LPDDR4 SDRAM-1 (U?#2.AA11), [7]-RK3399 SDRAM Page (U?#12.P1)
DDR0_D25: [1]-LPDDR4 SDRAM-1 (U?#2.Y11), [7]-RK3399 SDRAM Page (U?#12.P2)
DDR0_D26: [1]-LPDDR4 SDRAM-1 (U?#2.V11), [7]-RK3399 SDRAM Page (U?#12.N1)
DDR0_D27: [1]-LPDDR4 SDRAM-1 (U?#2.U11), [7]-RK3399 SDRAM Page (U?#12.M1)
DDR0_D28: [1]-LPDDR4 SDRAM-1 (U?#2.U9), [7]-RK3399 SDRAM Page (U?#12.N2)
DDR0_D29: [1]-LPDDR4 SDRAM-1 (U?#2.V9), [7]-RK3399 SDRAM Page (U?#12.L1)
DDR0_D30: [1]-LPDDR4 SDRAM-1 (U?#2.Y9), [7]-RK3399 SDRAM Page (U?#12.M2)
DDR0_D31: [1]-LPDDR4 SDRAM-1 (U?#2.AA9), [7]-RK3399 SDRAM Page (U?#12.L2)
DDR0_DM0: [1]-LPDDR4 SDRAM-1 (U?#2.C3), [7]-RK3399 SDRAM Page (U?#12.Y5)
DDR0_DM1: [1]-LPDDR4 SDRAM-1 (U?#2.C10), [7]-RK3399 SDRAM Page (U?#12.AC5)
DDR0_DM3: [1]-LPDDR4 SDRAM-1 (U?#2.Y10), [7]-RK3399 SDRAM Page (U?#12.P5)
DDR0_DQS0_N: [1]-LPDDR4 SDRAM-1 (U?#2.E3), [7]-RK3399 SDRAM Page (U?#12.AA4)
DDR0_DQS0_P: [1]-LPDDR4 SDRAM-1 (U?#2.D3), [7]-RK3399 SDRAM Page (U?#12.Y4)
DDR0_DQS1_N: [1]-LPDDR4 SDRAM-1 (U?#2.E10), [7]-RK3399 SDRAM Page (U?#12.AD4)
DDR0_DQS1_P: [1]-LPDDR4 SDRAM-1 (U?#2.D10), [7]-RK3399 SDRAM Page (U?#12.AC4)
DDR0_DQS2_N: [1]-LPDDR4 SDRAM-1 (U?#2.V3), [7]-RK3399 SDRAM Page (U?#12.V4)
DDR0_DQS2_P: [1]-LPDDR4 SDRAM-1 (U?#2.W3), [7]-RK3399 SDRAM Page (U?#12.U4)
DDR0_DQS3_N: [1]-LPDDR4 SDRAM-1 (U?#2.V10), [7]-RK3399 SDRAM Page (U?#12.R4)
DDR0_DQS3_P: [1]-LPDDR4 SDRAM-1 (U?#2.W10), [7]-RK3399 SDRAM Page (U?#12.P4)
DDR0_RST: [1]-LPDDR4 SDRAM-1 (U?#2.T11), [7]-RK3399 SDRAM Page (U?#12.L7)